# EAGLE design Cosmic Pi Main Board V2.5 OHL no logo (EAGLE 8.3.1)
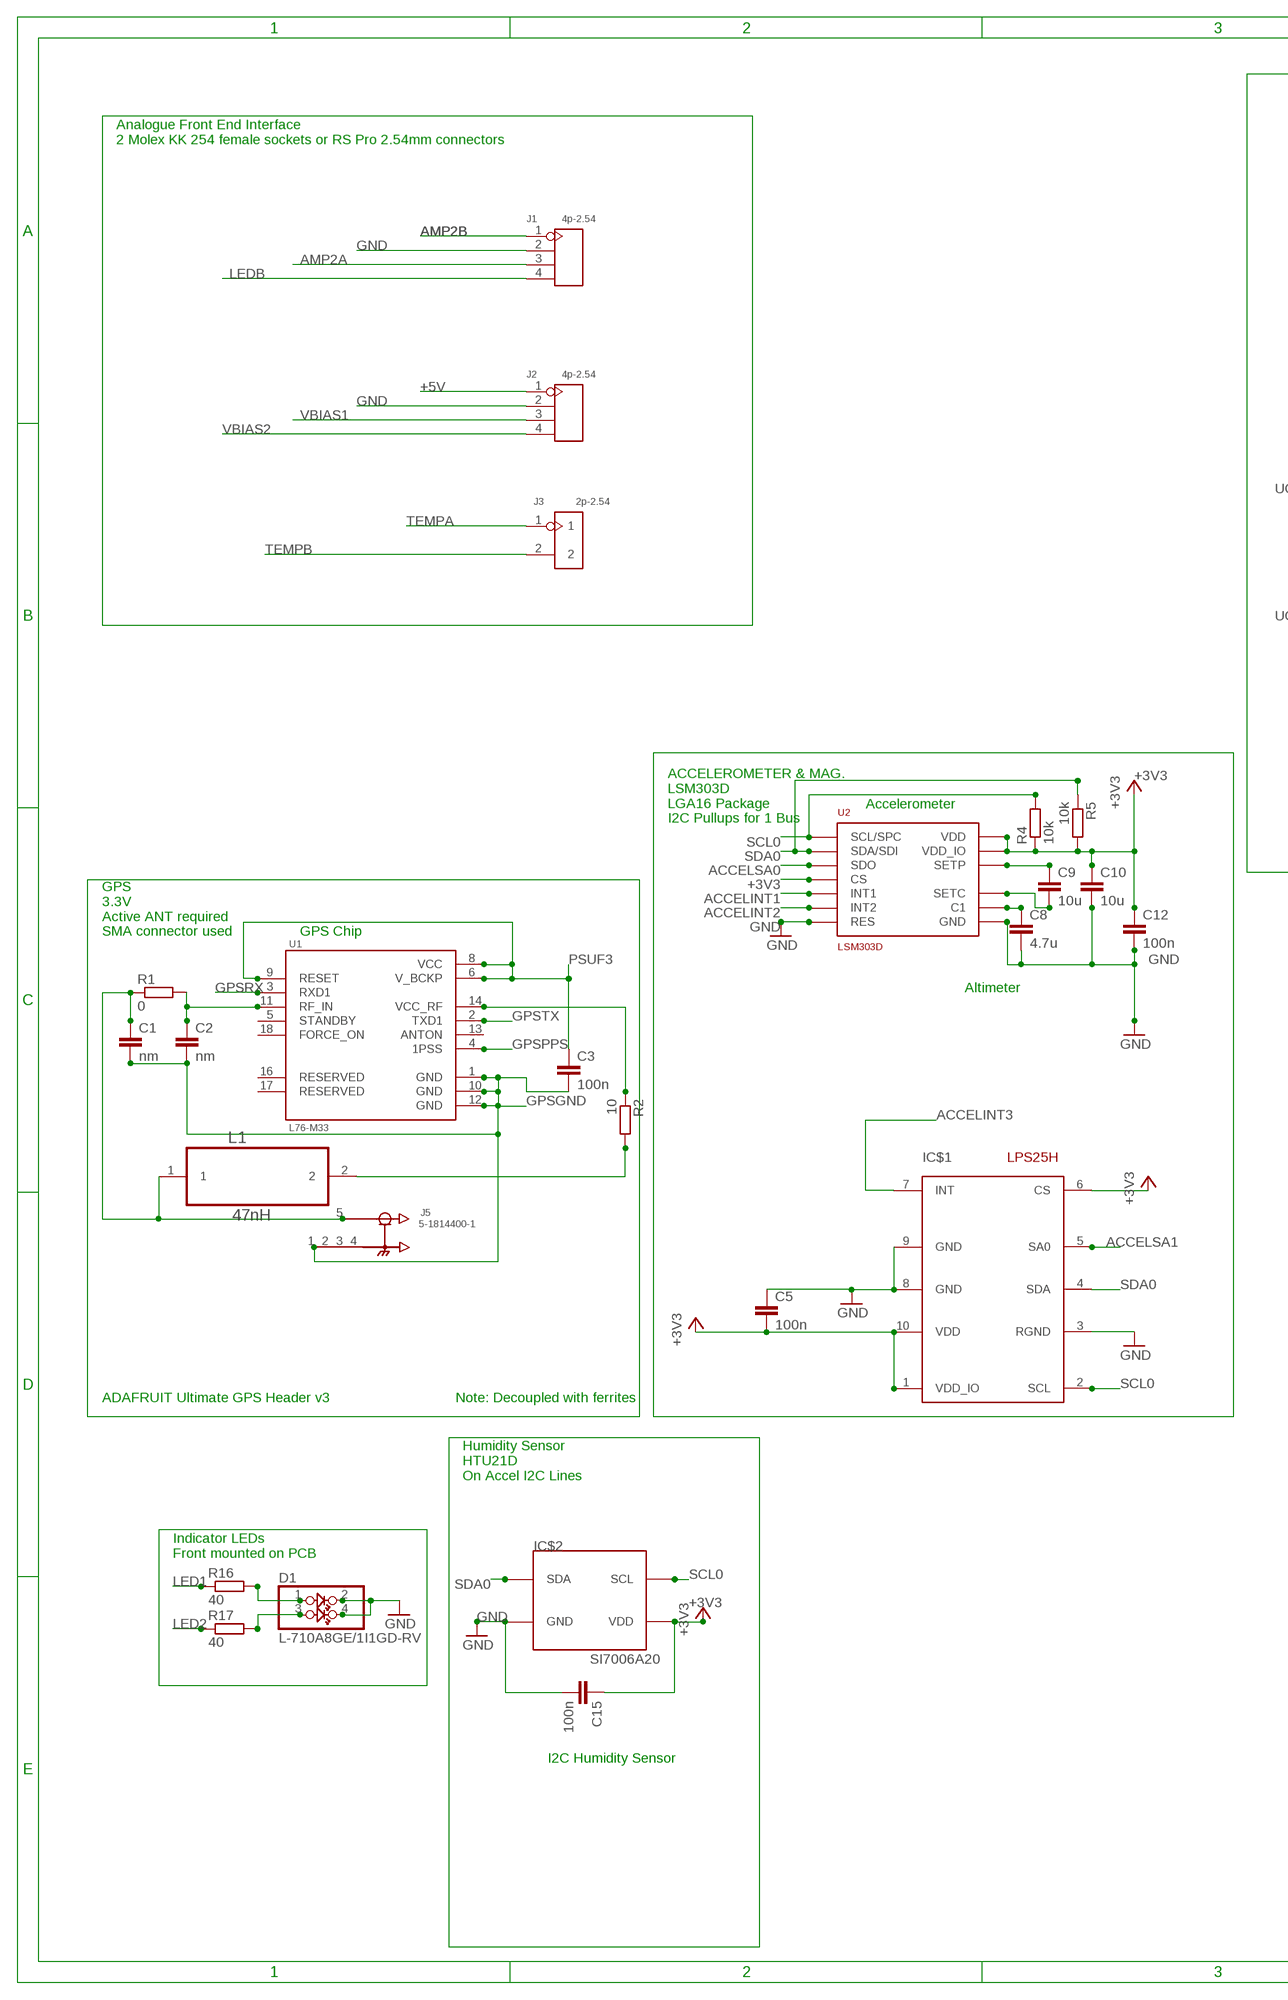
[diagram p0: schematic, sheet 1, part 1 of 2]
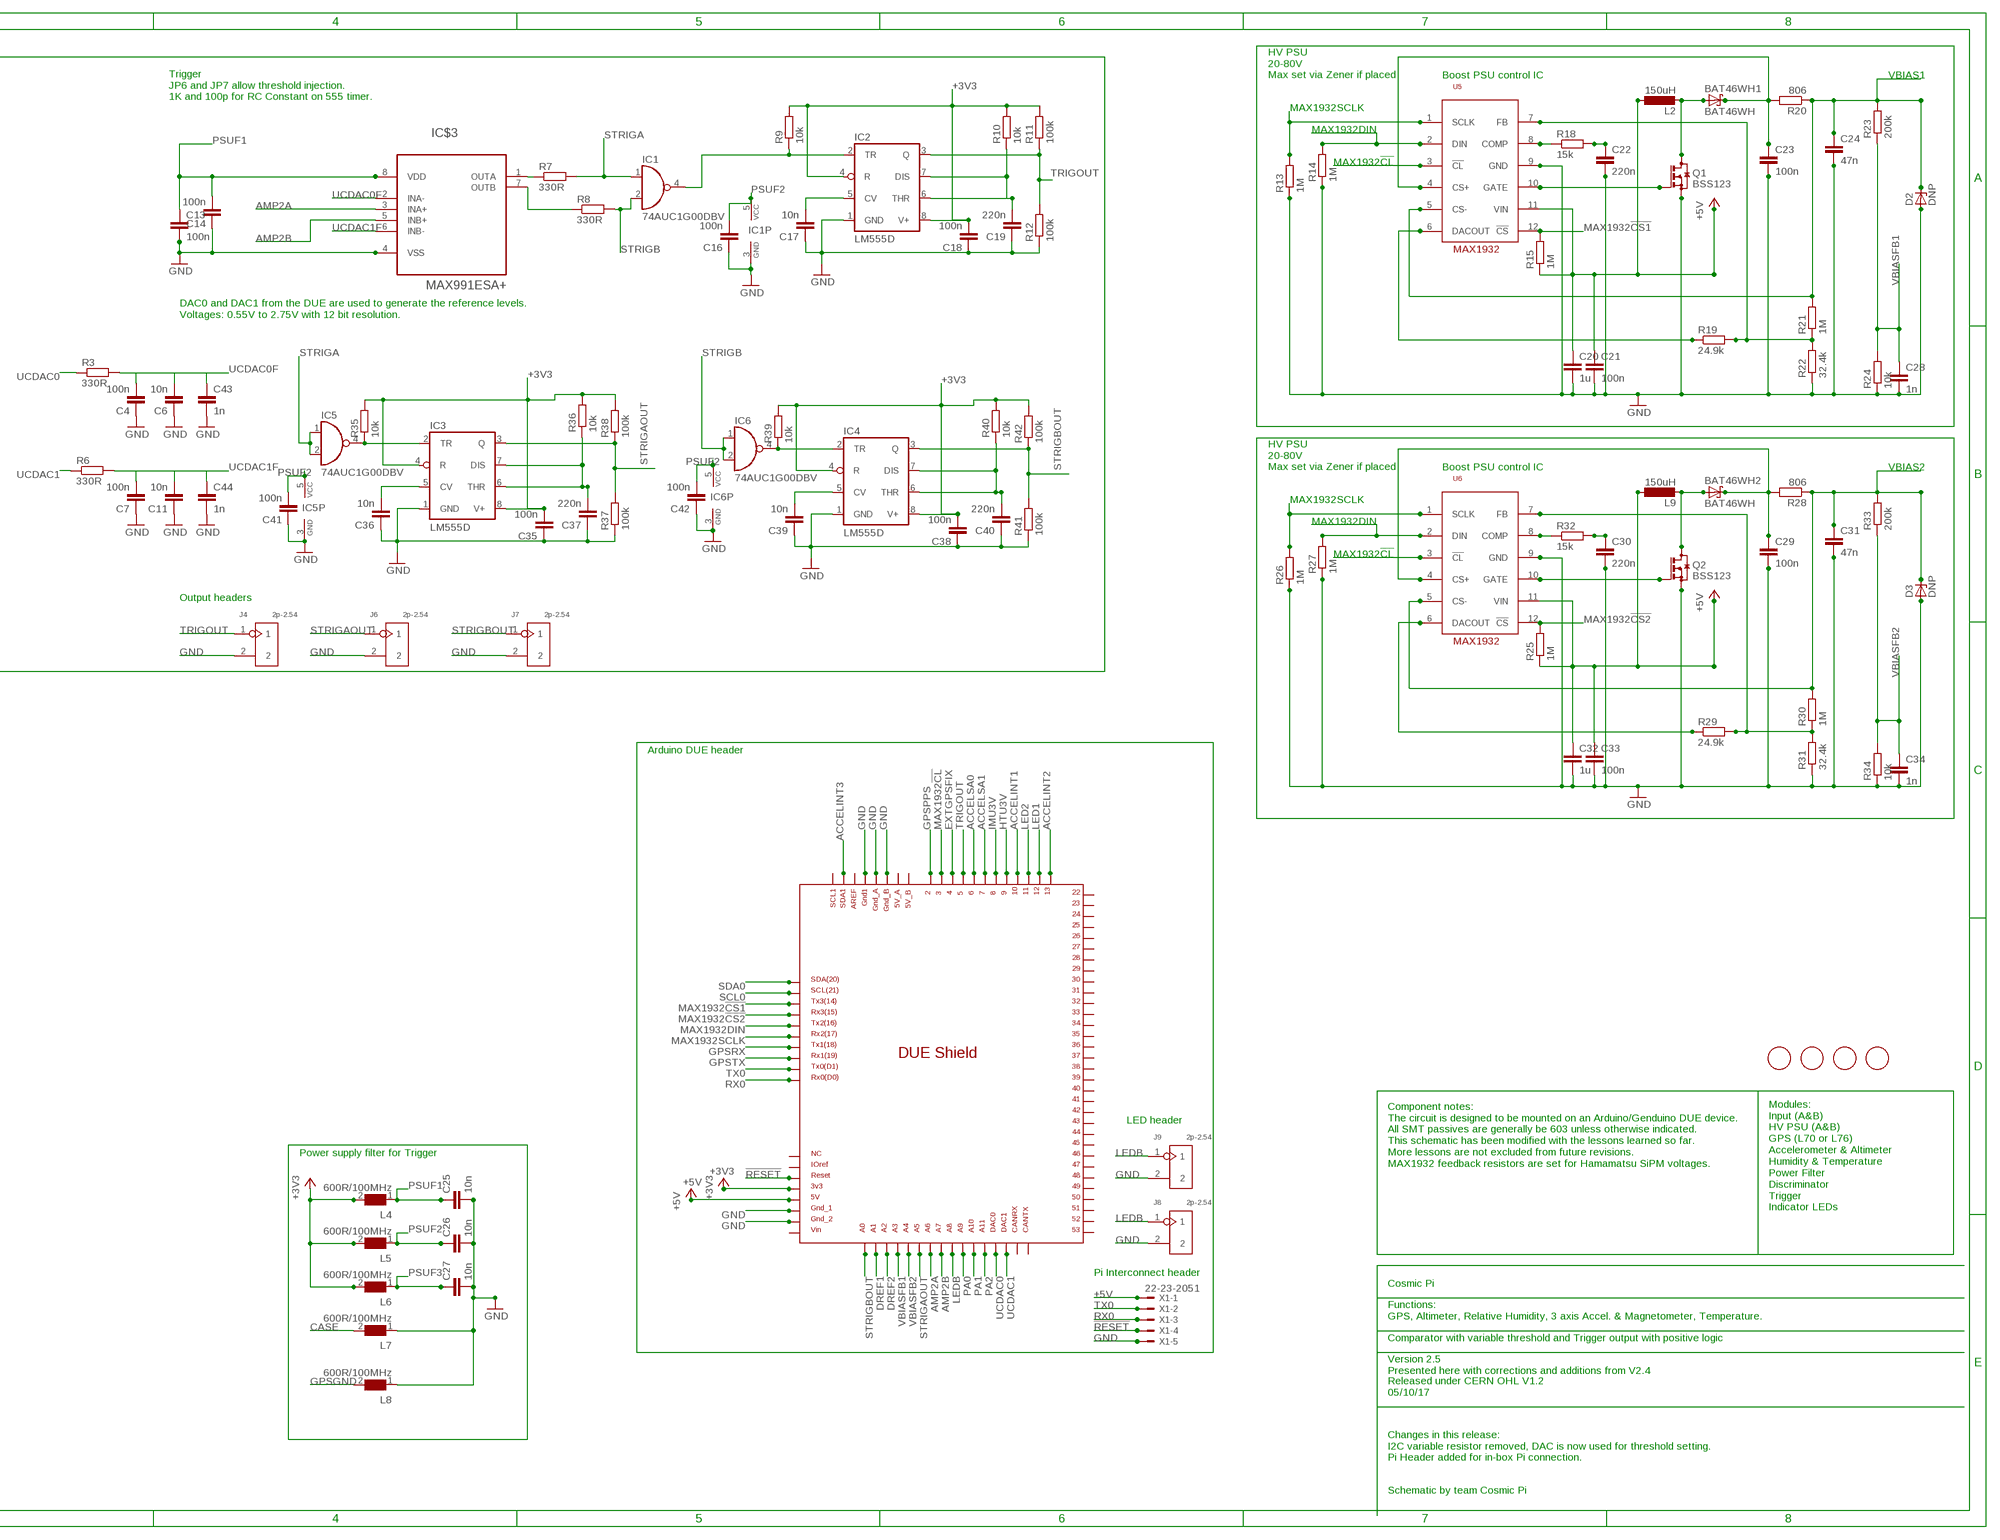
[diagram p1: schematic, sheet 1, part 2 of 2]

## Parts
BAT46WH1  BAT46WH  [SOD123F]
BAT46WH2  BAT46WH  [SOD123F]
C1  nm  C-EUC0603  [C0603]
C2  nm  C-EUC0603  [C0603]
C3  100n  C-EUC0603  [C0603]
C4  100n  C-EUC0603  [C0603]
C5  100n  C-EUC0603  [C0603]
C6  10n  C-EUC0603  [C0603]
C7  100n  C-EUC0603  [C0603]
C8  4.7u  C-EUC0603  [C0603]
C9  10u  C-EUC0603  [C0603]
C10  10u  C-EUC0603  [C0603]
C11  10n  C-EUC0603  [C0603]
C12  100n  C-EUC0603  [C0603]
C13  100n  C-EUC0603  [C0603]
C14  100n  C-EUC0603  [C0603]
C15  100n  C-EUC0603  [C0603]
C16  100n  C-EUC0603  [C0603]
C17  10n  C-EUC0603  [C0603]
C18  100n  C-EUC0603  [C0603]
C19  220n  C-EUC0603  [C0603]
C20  1u  C-EUC0603  [C0603]
C21  100n  C-EUC0603  [C0603]
C22  220n  C-EUC0603  [C0603]
C23  100n  C-EUC0603  [C0603]
C24  47n  C-EUC0603  [C0603]
C25  10n  C-EUC0603  [C0603]
C26  10n  C-EUC0603  [C0603]
C27  10n  C-EUC0603  [C0603]
C28  1n  C-EUC0603  [C0603]
C29  100n  C-EUC0603  [C0603]
C30  220n  C-EUC0603  [C0603]
C31  47n  C-EUC0603  [C0603]
C32  1u  C-EUC0603  [C0603]
C33  100n  C-EUC0603  [C0603]
C34  1n  C-EUC0603  [C0603]
C35  100n  C-EUC0603  [C0603]
C36  10n  C-EUC0603  [C0603]
C37  220n  C-EUC0603  [C0603]
C38  100n  C-EUC0603  [C0603]
C39  10n  C-EUC0603  [C0603]
C40  220n  C-EUC0603  [C0603]
C41  100n  C-EUC0603  [C0603]
C42  100n  C-EUC0603  [C0603]
C43  1n  C-EUC0603  [C0603]
C44  1n  C-EUC0603  [C0603]
D1  L-710A8GE/1I1GD-RV  KINGBRITET1  [2X02]
D2  DNP  ZENER-DIODESOT23  [SOT23]
D3  DNP  ZENER-DIODESOT23  [SOT23]
DUE1  DUE(NORMAL)  [DUE(NORMAL)]
IC1  74AUC1G00DBV  [SOT23-5]
IC2  LM555D  [SO08]
IC3  LM555D  [SO08]
IC4  LM555D  [SO08]
IC5  74AUC1G00DBV  [SOT23-5]
IC6  74AUC1G00DBV  [SOT23-5]
IC$1  LPS25H  [LPS25H]
IC$2  SI7006A20  [3X3DFN]
IC$3  MAX991ESA+  [SOIC-8]
J1  4p-2.54  DIP-BLACK-FEMALE-HEADER-VERT(4P-2.54)  [H4-2.54]
J2  4p-2.54  DIP-BLACK-FEMALE-HEADER-VERT(4P-2.54)  [H4-2.54]
J3  2p-2.54  DIP-BLACK-MALE-HEADER-VERT(2P-2.54)  [H2-2.54]
J4  2p-2.54  DIP-BLACK-MALE-HEADER-VERT(2P-2.54)  [H2-2.54]
J5  5-1814400-1  [TE_5-1814400-1]
J6  2p-2.54  DIP-BLACK-MALE-HEADER-VERT(2P-2.54)  [H2-2.54]
J7  2p-2.54  DIP-BLACK-MALE-HEADER-VERT(2P-2.54)  [H2-2.54]
J8  2p-2.54  DIP-BLACK-MALE-HEADER-VERT(2P-2.54)  [H2-2.54]
J9  2p-2.54  DIP-BLACK-MALE-HEADER-VERT(2P-2.54)  [H2-2.54]
L1  47nH  B82496C3470J  [INDC1608X90N]
L2  150uH  L-EUL1812  [L1812]
L4  600R/100MHz  WE-CBF-74279218_1206  [1206]
L5  600R/100MHz  WE-CBF-74279218_1206  [1206]
L6  600R/100MHz  WE-CBF-74279218_1206  [1206]
L7  600R/100MHz  WE-CBF-74279218_1206  [1206]
L8  600R/100MHz  WE-CBF-74279218_1206  [1206]
L9  150uH  L-EUL1812  [L1812]
Q1  BSS123  [SOT23]
Q2  BSS123  [SOT23]
R1  0  R-EU_R0603  [R0603]
R2  10  R-EU_R0603  [R0603]
R3  330R  R-EU_R0603  [R0603]
R4  10k  R-EU_R0603  [R0603]
R5  10k  R-EU_R0603  [R0603]
R6  330R  R-EU_R0603  [R0603]
R7  330R  R-EU_R0603  [R0603]
R8  330R  R-EU_R0603  [R0603]
R9  10k  R-EU_R0603  [R0603]
R10  10k  R-EU_R0603  [R0603]
R11  100k  R-EU_R0603  [R0603]
R12  100k  R-EU_R0603  [R0603]
R13  1M  R-EU_R0603  [R0603]
R14  1M  R-EU_R0603  [R0603]
R15  1M  R-EU_R0603  [R0603]
R16  40  R-EU_R0603  [R0603]
R17  40  R-EU_R0603  [R0603]
R18  15k  R-EU_R0603  [R0603]
R19  24.9k  R-EU_R0603  [R0603]
R20  806  R-EU_R0603  [R0603]
R21  1M  R-EU_R0603  [R0603]
R22  32.4k  R-EU_R0603  [R0603]
R23  200k  R-EU_R0603  [R0603]
R24  10k  R-EU_R0603  [R0603]
R25  1M  R-EU_R0603  [R0603]
R26  1M  R-EU_R0603  [R0603]
R27  1M  R-EU_R0603  [R0603]
R28  806  R-EU_R0603  [R0603]
R29  24.9k  R-EU_R0603  [R0603]
R30  1M  R-EU_R0603  [R0603]
R31  32.4k  R-EU_R0603  [R0603]
R32  15k  R-EU_R0603  [R0603]
R33  200k  R-EU_R0603  [R0603]
R34  10k  R-EU_R0603  [R0603]
R35  10k  R-EU_R0603  [R0603]
R36  10k  R-EU_R0603  [R0603]
R37  100k  R-EU_R0603  [R0603]
R38  100k  R-EU_R0603  [R0603]
R39  10k  R-EU_R0603  [R0603]
R40  10k  R-EU_R0603  [R0603]
R41  100k  R-EU_R0603  [R0603]
R42  100k  R-EU_R0603  [R0603]
U1  L76-M33  [CAPCAV110P970X1010X250-18N]
U2  LSM303D  [LGA16L]
U5  MAX1932  [TQFN-12]
U6  MAX1932  [TQFN-12]
U$1  FIDUCIAL  [FIDUCIAL_1MM]
U$2  FIDUCIAL  [FIDUCIAL_1MM]
U$3  FIDUCIAL  [FIDUCIAL_1MM]
U$4  FIDUCIAL  [FIDUCIAL_1MM]
X1  22-23-2051  [22-23-2051]

## Nets
!RESET: DUE1.RESET X1.4
+3V3 [Peripheral]: C5.2 C10.1 C12.1 C15.1 C18.2 C35.2 C38.2 DUE1.3V3 IC2.4(R) IC2.8(V+) IC3.4(R) IC3.8(V+) IC4.4(R) IC4.8(V+) IC$1.1(VDD_IO) IC$1.6(CS) IC$1.10(VDD) IC$2.P$5(VDD) L4.2 L5.2 L6.2 R4.1 R5.2 R9.2 R10.2 R11.2 R35.2 R36.2 R38.2 R39.2 R40.2 R42.2 U2.P$1(VDD_IO) U2.P$8(CS) U2.P$14(VDD)
+5V [PSU]: C20.1 C21.1 C32.1 C33.1 DUE1.5V J2.1 L2.1 L9.1 R15.1 R25.1 U5.11(VIN) U6.11(VIN) X1.1
ACCELINT1 [Peripheral]: DUE1.10 U2.P$11(INT1)
ACCELINT2 [Peripheral]: DUE1.13 U2.P$9(INT2)
ACCELINT3 [Peripheral]: DUE1.SDA1 IC$1.7(INT)
ACCELSA0 [Peripheral]: DUE1.6 U2.P$7(SDO)
ACCELSA1 [Peripheral]: DUE1.7 IC$1.5(SA0)
AMP2A [timing]: DUE1.A6 IC$3.3(INA+) J1.3
AMP2B [timing]: DUE1.A7 IC$3.5(INB+) J1.1
CASE [gnd]: L7.2
DREF1 [Peripheral]: DUE1.A1
DREF2 [Peripheral]: DUE1.A2
EXTGPSFIX [Peripheral]: DUE1.4
GND: C4.1 C5.1 C6.1 C7.1 C8.2 C10.2 C11.1 C12.2 C13.2 C14.1 C15.2 C16.1 C17.1 C18.1 C19.1 C20.2 C21.2 C22.2 C23.2 C24.2 C25.2 C26.2 C27.2 C28.2 C29.2 C30.2 C31.2 C32.2 C33.2 C34.2 C35.1 C36.1 C37.1 C38.1 C39.1 C40.1 C41.1 C42.1 C43.2 C44.2 D1.2 D1.4 D2.1(A) D3.1(A) DUE1.GND1 DUE1.GND_1 DUE1.GND_2 DUE1.GND_A DUE1.GND_B IC1.3(GND) IC2.1(GND) IC3.1(GND) IC4.1(GND) IC5.3(GND) IC6.3(GND) IC$1.3(RGND) IC$1.8(GND) IC$1.9(GND) IC$2.P$2(GND) IC$3.4(VSS) J1.2 J2.2 J4.2 J6.2 J7.2 J8.2 J9.2 L7.1 L8.1 Q1.2(S) Q2.2(S) R12.1 R13.1 R14.1 R22.1 R24.1 R26.1 R27.1 R31.1 R34.1 R37.1 R41.1 U2.P$5(GND) U2.P$10(RES) U2.P$12(GND) U2.P$13(GND) U2.P$16(GND) U5.9(GND) U6.9(GND) X1.5
GPSGND [timing]: C1.2 C2.2 C3.2 J5.1(GND) L8.2 U1.1(GND) U1.10(GND) U1.12(GND)
GPSPPS [timing]: DUE1.2 U1.4(1PSS)
GPSRX [Comms]: DUE1.TX1 U1.3(RXD1)
GPSTX [Comms]: DUE1.RX1 U1.2(TXD1)
HTU3V [Peripheral]: DUE1.9
IMU3V [Peripheral]: DUE1.8
LED1: DUE1.12 R16.1
LED2: DUE1.11 R17.1
LEDB: DUE1.A8 J1.4 J8.1 J9.1
MAX1932!CL: DUE1.3 U5.3(!CL) U6.3(!CL)
MAX1932!CS1: DUE1.TX3 R15.2 U5.12(!CS)
MAX1932!CS2: DUE1.RX3 R25.2 U6.12(!CS)
MAX1932DIN: DUE1.TX2 R14.2 R27.2 U5.2(DIN) U6.2(DIN)
MAX1932SCLK: DUE1.RX2 R13.2 R26.2 U5.1(SCLK) U6.1(SCLK)
N$2: IC$3.1(OUTA) R7.1
N$4: IC$3.7(OUTB) R8.1
N$5 [Peripheral]: C17.2 IC2.5(CV)
N$6 [Peripheral]: C19.2 IC2.6(THR) IC2.7(DIS) R10.1
N$7 [Peripheral]: C36.2 IC3.5(CV)
N$8: Q2.1(G) U6.10(GATE)
N$9 [Vbias]: BAT46WH2.2(A) L9.2 Q2.3(D)
N$10 [Vbias]: BAT46WH2.1(K) C29.1 R28.2 U6.4(CS+)
N$11: R29.1 U6.6(DACOUT)
N$12: R32.1 U6.8(COMP)
N$13: C30.1 R32.2
N$14: R29.2 R30.1 R31.2 U6.7(FB)
N$17 [Peripheral]: C37.2 IC3.6(THR) IC3.7(DIS) R36.1
N$18: IC1.4(O) IC2.2(TR) R9.1
N$19: Q1.1(G) U5.10(GATE)
N$21 [Peripheral]: C39.2 IC4.5(CV)
N$22 [Peripheral]: C40.2 IC4.6(THR) IC4.7(DIS) R40.1
N$24: IC4.2(TR) IC6.4(O) R39.1
N$25: IC3.2(TR) IC5.4(O) R35.1
N$31 [Vbias]: BAT46WH1.2(A) L2.2 Q1.3(D)
N$32 [Vbias]: BAT46WH1.1(K) C23.1 R20.2 U5.4(CS+)
N$47: R19.2 R21.1 R22.2 U5.7(FB)
N$53 [ant]: C1.1 J5.5(SIG) L1.1 R1.1
N$54: R19.1 U5.6(DACOUT)
N$55: R18.1 U5.8(COMP)
N$56: C22.1 R18.2
N$63 [Peripheral]: C9.1 U2.P$3(SETP)
N$64 [Peripheral]: C9.2 U2.P$2(SETC)
N$65 [Peripheral]: C8.1 U2.P$15(C1)
N$66 [Peripheral]: L1.2 R2.2
N$67 [Peripheral]: R2.1 U1.14(VCC_RF)
N$68 [ant]: C2.1 R1.2 U1.11(RF_IN)
N$72: D1.1 R16.2
N$73: D1.3 R17.2
PA0 [Peripheral]: DUE1.A9
PA1 [Peripheral]: DUE1.A10
PA2 [Peripheral]: DUE1.A11
PSUF1 [PSU]: C13.1 C14.2 C25.1 IC$3.8(VDD) L4.1
PSUF2 [PSU]: C16.2 C26.1 C41.2 C42.2 IC1.5(VCC) IC5.5(VCC) IC6.5(VCC) L5.1
PSUF3 [timing]: C3.1 C27.1 L6.1 U1.6(V_BCKP) U1.8(VCC) U1.9(RESET)
RX0: DUE1.RX0 X1.3
SCL0 [Comms]: DUE1.SCL IC$1.2(SCL) IC$2.P$6(SCL) R4.2 U2.P$4(SCL/SPC)
SDA0 [Comms]: DUE1.SDA IC$1.4(SDA) IC$2.P$1(SDA) R5.1 U2.P$6(SDA/SDI)
STRIGA [timing]: IC1.1(I0) IC5.1(I0) IC5.2(I1) R7.2
STRIGAOUT [timing]: DUE1.A5 IC3.3(Q) J6.1 R37.2 R38.1
STRIGB [timing]: IC1.2(I1) IC6.1(I0) IC6.2(I1) R8.2
STRIGBOUT [timing]: DUE1.A0 IC4.3(Q) J7.1 R41.2 R42.1
TEMPA: J3.1
TEMPB: J3.2
TRIGOUT [timing]: DUE1.5 IC2.3(Q) J4.1 R11.1 R12.2
TX0: DUE1.TX0 X1.2
UCDAC0: DUE1.DAC0 R3.1
UCDAC0F: C4.2 C6.2 C43.1 IC$3.2(INA-) R3.2
UCDAC1: DUE1.DAC1 R6.1
UCDAC1F: C7.2 C11.2 C44.1 IC$3.6(INB-) R6.2
VBIAS1 [Vbias]: C24.1 D2.3(C) J2.3 R20.1 R21.2 R23.2 U5.5(CS-)
VBIAS2 [Vbias]: C31.1 D3.3(C) J2.4 R28.1 R30.2 R33.2 U6.5(CS-)
VBIASFB1: C28.1 DUE1.A3 R23.1 R24.2
VBIASFB2: C34.1 DUE1.A4 R33.1 R34.2
Unconnected: DUE1.5V_A DUE1.5V_B DUE1.22 DUE1.23 DUE1.24 DUE1.25 DUE1.26 DUE1.27 DUE1.28 DUE1.29 DUE1.30 DUE1.31 DUE1.32 DUE1.33 DUE1.34 DUE1.35 DUE1.36 DUE1.37 DUE1.38 DUE1.39 DUE1.40 DUE1.41 DUE1.42 DUE1.43 DUE1.44 DUE1.45 DUE1.46 DUE1.47 DUE1.48 DUE1.49 DUE1.50 DUE1.51 DUE1.52 DUE1.53 DUE1.AREF DUE1.CANRX DUE1.CANTX DUE1.IOREF DUE1.NC DUE1.SCL1 DUE1.VIN J5.2(GND) J5.3(GND) J5.4(GND) U1.5(STANDBY) U1.13(ANTON) U1.16(RESERVED) U1.17(RESERVED) U1.18(FORCE_ON)

## Notes on the sheet
- HV PSU
  20-80V
  Max set via Zener if placed
- Boost PSU control IC
- Trigger
  JP6 and JP7 allow threshold injection.
  1K and 100p for RC Constant on 555 timer.
- Analogue Front End Interface
  2 Molex KK 254 female sockets or RS Pro 2.54mm connectors
- DAC0 and DAC1 from the DUE are used to generate the reference levels.
  Voltages: 0.55V to 2.75V with 12 bit resolution.
- HV PSU
  20-80V
  Max set via Zener if placed
- Boost PSU control IC
- Output headers
- Accelerometer
- ACCELEROMETER & MAG.
  LSM303D
  LGA16 Package
  I2C Pullups for 1 Bus
- GPS
  3.3V
  Active ANT required
  SMA connector used
- GPS Chip
- Arduino DUE header
- Altimeter
- ADAFRUIT Ultimate GPS Header v3 | Note: Decoupled with ferrites
- LED header
- Humidity Sensor
  HTU21D
  On Accel I2C Lines
- Power supply filter for Trigger
- Component notes:
  The circuit is designed to be mounted on an Arduino/Genduino DUE device.
  All SMT passives are generally be 603 unless otherwise indicated.
  This schematic has been modified with the lessons learned so far.
  More lessons are not excluded from future revisions.
  MAX1932 feedback resistors are set for Hamamatsu SiPM voltages.
- Indicator LEDs
  Front mounted on PCB
- Modules:
  Input (A&B)
  HV PSU (A&B)
  GPS (L70 or L76)
  Accelerometer & Altimeter
  Humidity & Temperature
  Power Filter
  Discriminator
  Trigger
  Indicator LEDs
- Pi Interconnect header
- Cosmic Pi
- Functions:
  GPS, Altimeter, Relative Humidity, 3 axis Accel. & Magnetometer, Temperature.
- Comparator with variable threshold and Trigger output with positive logic
- I2C Humidity Sensor
- Version 2.5
  Presented here with corrections and additions from V2.4
- Released under CERN OHL V1.2
  05/10/17
- Changes in this release:
  I2C variable resistor removed, DAC is now used for threshold setting.
  Pi Header added for in-box Pi connection.
- Schematic by team Cosmic Pi

## Library data of the parts
BAT46WH1 BAT46WH2 = BAT46Wsymbol:BAT46W: Single Schottky barrier diode Single planar Schottky barrier diode with an integrated guard ring for stress protection, encapsulated in a Surface-Mounted Device (SMD) plastic package. AAL Eindhoven MK
C1-C21 C25-C27 C32 C33 C35-C42 = resistor:C-EU: CAPACITOR, European symbol
C22-C24 C28-C31 C34 C43 C44 = rcl:C-EU: CAPACITOR, European symbol
D1 = KingbriteBiLevel T1:KINGBRITET1: PIN HEADER
D2 D3 = diode:ZENER-DIODE: Z-Diode
DUE1 = DUElib130425:DUE(NORMAL)
IC1 IC5 IC6 = 74xx-little-de:74*1G00: 2-input NAND gate
IC2-IC4 = linear:*555: TIMER
IC$1 = LPS25H:LPS25H: ST-Micro Piezoresistive pressure sensor
IC$2 = SI7006:SI7006
IC$3 = MAX9916EKA_T:MAX991ESA+
J1 J2 = Seeed-Connector:DIP-BLACK-FEMALE-HEADER-VERT(4P-2.54): 320030017; MPN: F185-1104A1BSYA1
J3 J4 J6-J9 = Seeed-Connector:DIP-BLACK-MALE-HEADER-VERT(2P-2.54): 320020016; MPN: P125-1102A0BS116A1
J5 = 5-1814400-1:5-1814400-1: Conn SMA RCP 0Hz to 3GHz 50Ohm Solder RA Thru-Hole Gold Over Nickel Over Copper
L1 = B82496C3470J:B82496C3470J: INDUCTOR, 47NH 270MA 5%
L2 L9 = rcl:L-EU: INDUCTOR, European symbol
L4-L8 = WE-CBF:WE-CBF: SMD EMI Suppression Ferrite Beads WE-CBF - Excellent anti-EMI properties - Low DC-restistance - Impedances till 3000 ohms - Rated current up to 6 A -- Reliable Ni-Sn electrodes -- Perfect as data lined filter and for uncoupling of distribution voltage; MPN: 74279218; OC_FARNELL: 1635758; OC_NEWARK: 08P2403; PACKAGE: IND-1206; SUPPLIER: Wuerth Elektronik
Q1 Q2 = transistor-small-signal:BSS123: N-CHANNEL MOS FET
R1-R42 = resistor:R-EU_: RESISTOR, European symbol
U1 = L76-M33:L76-M33: GPS Receiver 1575.42MHz 2.5V/3.3V 18-Pin
U2 = LSM303D:LSM303D
U5 U6 = TQFN-12:MAX1932
U$1-U$4 = adafruit:FIDUCIAL: For use by pick and place machines to calibrate the vision/machine, 1mm By microbuilder.eu
X1 = con-molex:22-23-2051: .100" (2.54mm) Center Header - 5 Pin; MF: MOLEX; MPN: 22-23-2051; OC_FARNELL: 1462952; OC_NEWARK: 38C9178

## Net classes
0 default: width 0.152 mm, drill 0.406 mm, clearance 0.152 mm
1 Peripheral: width 0.152 mm, drill 0.406 mm, clearance 0.152 mm to class 0, clearance 0.152 mm
2 gnd: width 0.305 mm, drill 0.406 mm, clearance 0.205 mm to class 0, clearance 0.205 mm to class 1, clearance 0.254 mm
3 timing: width 0.152 mm, drill 0.406 mm, clearance 0.152 mm to class 0, clearance 0.152 mm to class 1, clearance 0.152 mm to class 2, clearance 0.152 mm
4 Comms: width 0.152 mm, drill 0.406 mm, clearance 0.152 mm to class 0, clearance 0.152 mm to class 1, clearance 0.152 mm to class 2, clearance 0.152 mm to class 3, clearance 0.152 mm
5 PSU: width 0.152 mm, drill 0.406 mm, clearance 0.152 mm to class 0, clearance 0.152 mm to class 1, clearance 0.152 mm to class 2, clearance 0.152 mm to class 3, clearance 0.152 mm to class 4, clearance 0.152 mm
6 Vbias: width 0.152 mm, drill 0.406 mm, clearance 0.254 mm to class 0, clearance 0.254 mm to class 1, clearance 0.254 mm to class 2, clearance 0.254 mm to class 3, clearance 0.254 mm to class 4, clearance 0.254 mm to class 5, clearance 0.356 mm
7 ant: width 0.61 mm, drill 0.406 mm, clearance 0.61 mm to class 0, clearance 0.61 mm to class 1, clearance 0.61 mm to class 2, clearance 0.61 mm to class 3, clearance 0.61 mm to class 4, clearance 0.61 mm to class 5, clearance 0.61 mm to class 6, clearance 0.61 mm

## Board
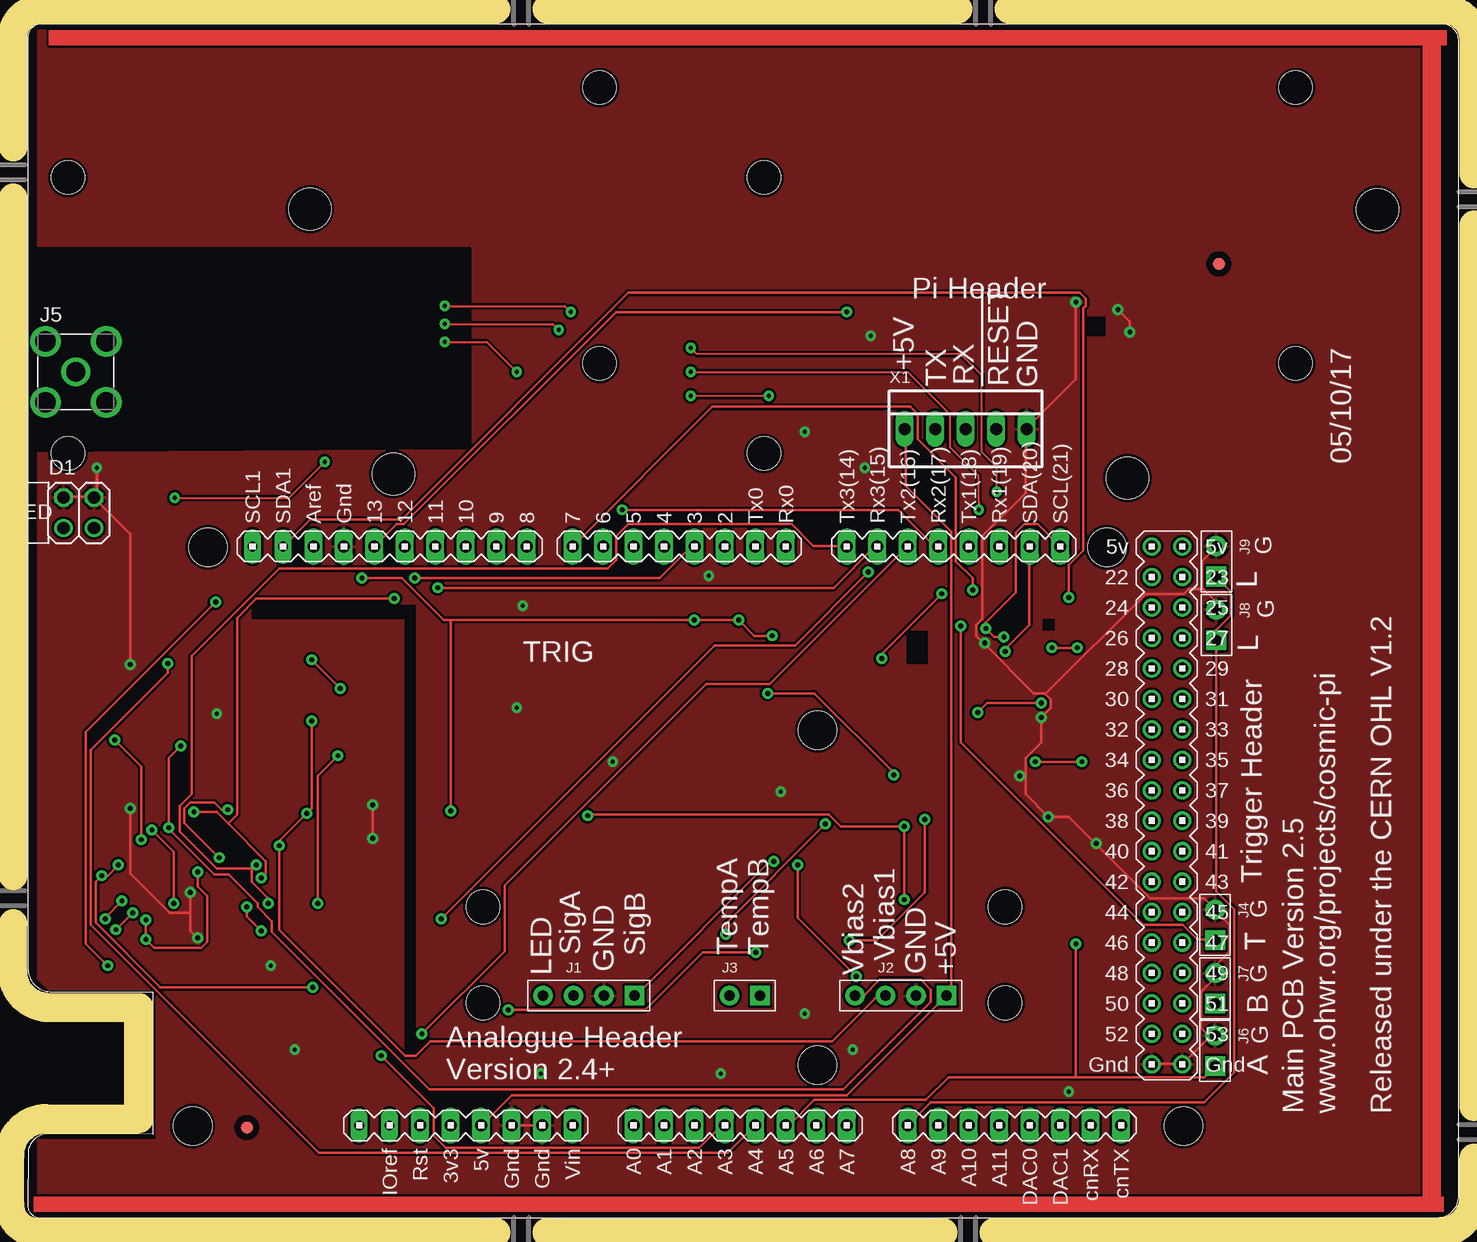
[diagram p2: board, top side]
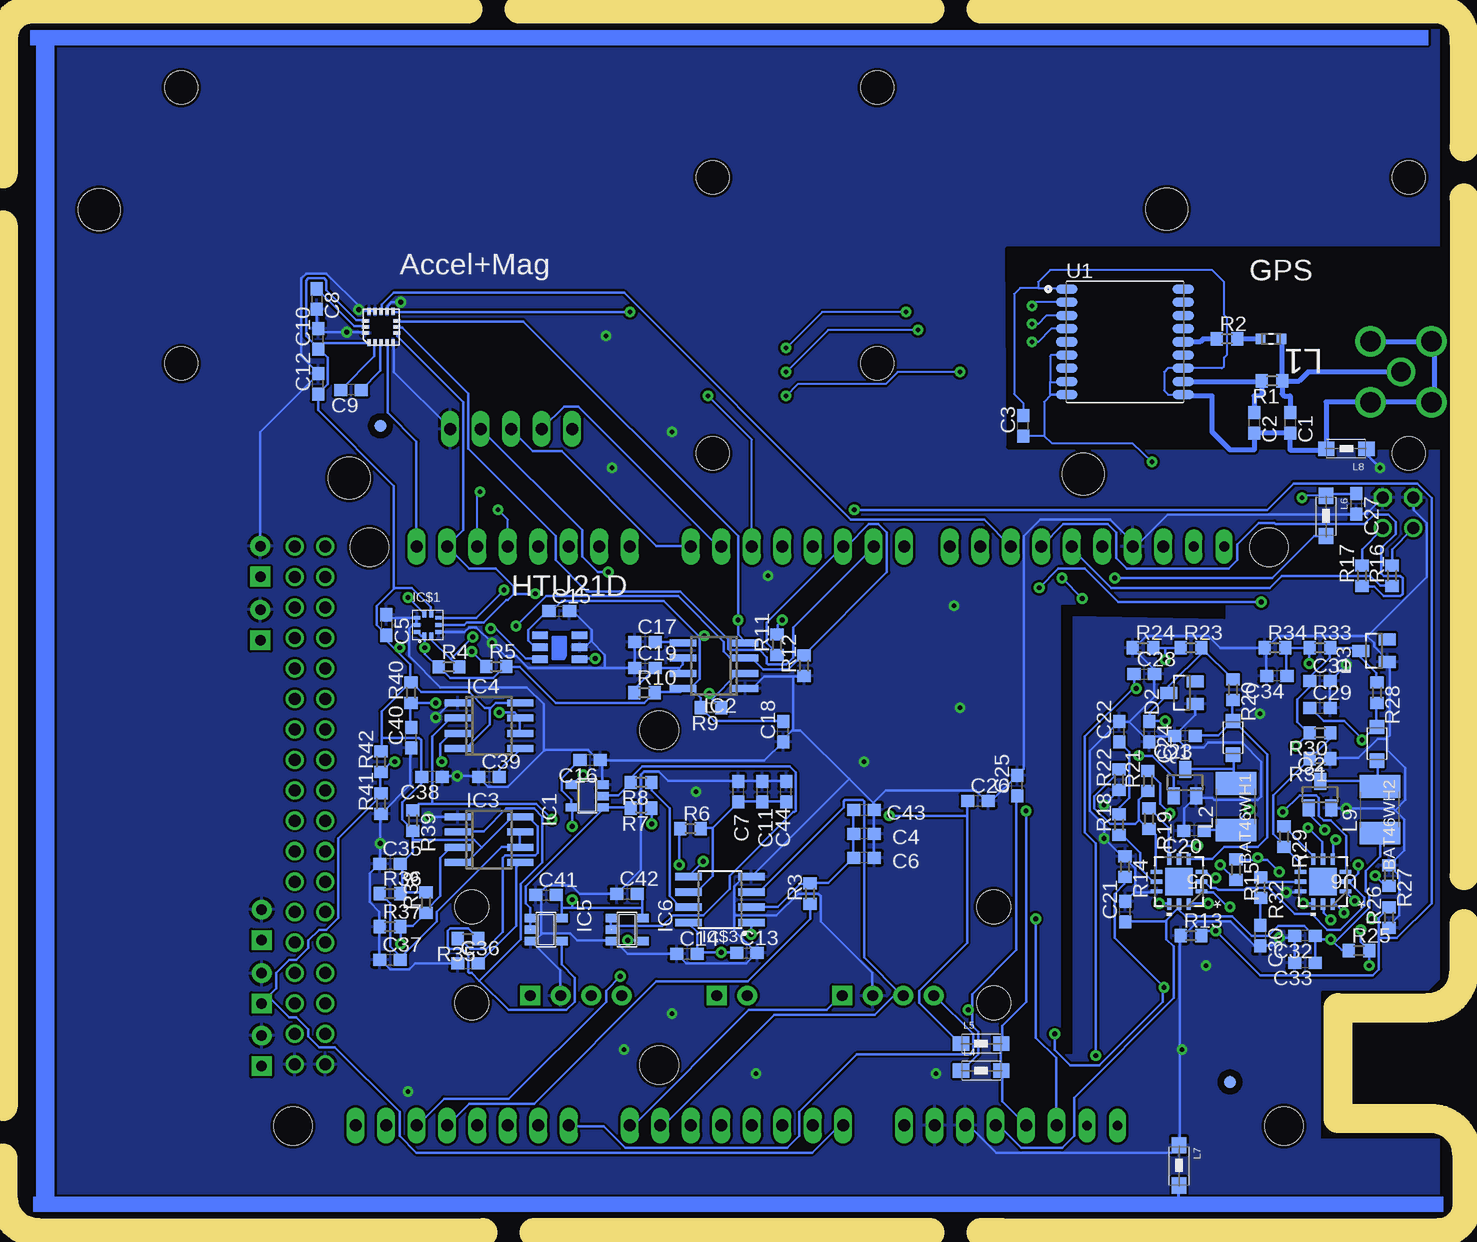
[diagram p3: board, bottom side, seen from below]

No outline drawn. Coordinates in mm, seen from the top.
Copper layers (1*16): Top 0.035mm / dielectric 1.5mm / Bottom 0.035mm
Design rules "pcbtrain github": minimum track width 0.2mm, minimum drill 0.4mm, track to track 0.2mm, track to pad 0.2mm, pad to pad 0.2mm, via to via 0.2mm, smd to smd 0mil, copper to edge 10mil, drill to drill 0.2mm, minimum pad ring 10mil, minimum via ring 10mil, stop-mask expansion 0.125mm, vias tented up to drill 0mil, thermal gap 10mil
Holes 3.2 mm at 96.58,7.62 15.27,55.88 90.2,55.88 14,7.62 66.07,40.64 66.07,12.7
Holes 2.8 mm at 81.69,17.89 38.19,17.89 81.69,25.89 38.19,25.89
Holes 3.5 mm at 23.76,84.07 91.89,61.64 112.72,84.03 30.72,61.99
Holes 2.75 mm at 3.6,86.7 61.6,86.7 3.6,63.7 61.6,63.7 47.9,94.2 105.9,94.2 47.9,71.2 105.9,71.2
tKeepout: area -0.2,6.8 to 10.8,18.9
bKeepout: area -0.2,6.7 to 10.8,18.9
tRestrict: area 23.6,68.2 to 30.9,77.8; area 73.5,46.2 to 75.2,48.9; area 84.8,48.9 to 85.8,49.9; area 88.5,73.5 to 90,75.1; area 0,0 to 1,2; area -0.2,97 to 0.8,99.5; area 19,13.8 to 32.5,51; area -0.5,64 to 37,80.7; area -0.2,-0.3 to 1,99.5; area 118.5,0.3 to 120.2,100.8; area -0.2,6.8 to 10.8,18.9
bRestrict: area 88.5,73.5 to 90,75.1; area 84.8,48.9 to 85.8,49.9; area 73.5,46.2 to 75.2,48.9; area 23.6,68.2 to 30.9,77.8; area 19,13.8 to 32.5,51; area 0,0 to 1,2; area -0.2,97 to 0.8,99.5; area -0.5,64.2 to 37,80.7; area 118.5,0.3 to 120.2,100.8; area -0.2,-0.3 to 1,99.5; area -0.1,6.7 to 10.8,18.9
Milling: 24 lines

### Footprints (pad centres in the part's own frame; a part is rotated, then mirrored left to right if it is on the bottom)
SOD123F = smd 1.2 x 1.2: 1 -1.4,0; 2 1.4,0
C0603 = smd 1.1 x 1: 1 -0.85,0; 2 0.85,0
2X02 = drill 1.016: 1 -1.27,-1.27; 3 1.27,-1.27 | drill 1.016 octagon: 2 -1.27,1.27; 4 1.27,1.27
SOT23 = smd 1 x 1.4: 1 -0.95,-1.1; 2 0.95,-1.1; 3 0,1.1
DUE(NORMAL) = drill 1 long: 2 -16.51,30.48; 3 -19.05,30.48; 3V3 -39.37,-17.78; 4 -21.59,30.48; 5 -24.13,30.48; 5V -36.83,-17.78; 6 -26.67,30.48; 7 -29.21,30.48; 8 -33.02,30.48; 9 -35.56,30.48; 10 -38.1,30.48; 11 -40.64,30.48; 12 -43.18,30.48; 13 -45.72,30.48; A0 -24.13,-17.78; A1 -21.59,-17.78; A2 -19.05,-17.78; A3 -16.51,-17.78; A4 -13.97,-17.78; A5 -11.43,-17.78; A6 -8.89,-17.78; A7 -6.35,-17.78; A8 -1.27,-17.78; A9 1.27,-17.78; A10 3.81,-17.78; A11 6.35,-17.78; AREF -50.8,30.48; AREF1 -50.8,30.48; CANRX 13.97,-17.78; CANTX 16.51,-17.78; DAC0 8.89,-17.78; DAC1 11.43,-17.78; GND1 -48.26,30.48; GND_1 -34.29,-17.78; GND_2 -31.75,-17.78; RESET -41.91,-17.78; RX0 -11.43,30.48; RX1 6.35,30.48; RX2 1.27,30.48; RX3 -3.81,30.48; SCL 11.43,30.48; SDA 8.89,30.48; TX0 -13.97,30.48; TX1 3.81,30.48; TX2 -1.27,30.48; TX3 -6.35,30.48; VIN -29.21,-17.78 | drill 1: 5V_A 19.05,30.48; 5V_B 21.59,30.48; 22 19.05,27.94; 23 21.59,27.94; 24 19.05,25.4; 25 21.59,25.4; 26 19.05,22.86; 27 21.59,22.86; 28 19.05,20.32; 29 21.59,20.32; 30 19.05,17.78; 31 21.59,17.78; 32 19.05,15.24; 33 21.59,15.24; 34 19.05,12.7; 35 21.59,12.7; 36 19.05,10.16; 37 21.59,10.16; 38 19.05,7.62; 39 21.59,7.62; 40 19.05,5.08; 41 21.59,5.08; 42 19.05,2.54; 43 21.59,2.54; 44 19.05,0; 45 21.59,0; 46 19.05,-2.54; 47 21.59,-2.54; 48 19.05,-5.08; 49 21.59,-5.08; 50 19.05,-7.62; 51 21.59,-7.62; 52 19.05,-10.16; 53 21.59,-10.16; GND_A 19.05,-12.7; GND_B 21.59,-12.7 | drill 0.8 pad 1.422 long: IOREF -44.45,-17.78; NC -46.99,-17.78; SCL1 -55.88,30.48; SDA1 -53.34,30.48
SOT23-5 = smd 0.69 x 0.99: 1 -0.95,-1.29; 2 0,-1.29; 3 0.95,-1.29; 4 0.95,1.3; 5 -0.95,1.3
SO08 = smd 0.6 x 2.2: 1 -1.905,-2.6; 2 -0.635,-2.6; 3 0.635,-2.6; 4 1.905,-2.6; 5 1.905,2.6; 6 0.635,2.6; 7 -0.635,2.6; 8 -1.905,2.6
LPS25H = smd 0.32 x 0.55: 1 -0.3,-0.9; 2 0.3,-0.9; 6 0.3,0.9; 7 -0.3,0.9 | smd 0.55 x 0.32: 3 0.9,-0.6; 4 0.9,0; 5 0.9,0.6; 8 -0.9,0.6; 9 -0.9,0; 10 -0.9,-0.6
3X3DFN = smd 1.27 x 0.635: P$1 -0.2,0; P$2 -0.2,-1; P$3 -0.2,-2; P$4 3.1,-2; P$5 3.1,-1; P$6 3.1,0
SOIC-8 = smd 0.61 x 2.21: 1 -1.905,-2.616; 2 -0.635,-2.616; 3 0.635,-2.616; 4 1.905,-2.616; 5 1.905,2.616; 6 0.635,2.616; 7 -0.635,2.616; 8 -1.905,2.616
H4-2.54 = drill 0.889 pad 1.651 square: 1 0,3.81 | drill 0.889 pad 1.651: 2 0,1.27; 3 0,-1.27; 4 0,-3.81
H2-2.54 = drill 0.889 pad 1.651 square: 1 0,1.27 | drill 0.889 pad 1.651: 2 0,-1.27
TE_5-1814400-1 = drill 1.7 pad 2.3: 1 -2.54,2.54; 2 -2.54,-2.54; 3 2.54,-2.54; 4 2.54,2.54 | drill 1.6 pad 2.2: 5 0,0
INDC1608X90N = smd 0.787 x 0.889: 1 -0.889,0; 2 0.889,0
L1812 = smd 1.9 x 3.4: 1 -1.95,0; 2 1.95,0
1206 = smd 1.35 x 1.2: 1 -1.675,0; 2 1.675,0
R0603 = smd 1 x 1.1: 1 -0.85,0; 2 0.85,0
CAPCAV110P970X1010X250-18N = smd 1.8 x 0.8: 1 -4.85,4.4; 2 -4.85,3.3; 3 -4.85,2.2; 4 -4.85,1.1; 5 -4.85,0; 6 -4.85,-1.1; 7 -4.85,-2.2; 8 -4.85,-3.3; 9 -4.85,-4.4; 10 4.85,-4.4; 11 4.85,-3.3; 12 4.85,-2.2; 13 4.85,-1.1; 14 4.85,0; 15 4.85,1.1; 16 4.85,2.2; 17 4.85,3.3; 18 4.85,4.4
LGA16L = smd 0.6 x 0.3: P$1 -1.3,1; P$2 -1.3,0.5; P$3 -1.3,0; P$4 -1.3,-0.5; P$5 -1.3,-1; P$9 1.3,-1; P$10 1.3,-0.5; P$11 1.3,0; P$12 1.3,0.5; P$13 1.3,1 | smd 0.3 x 0.6: P$6 -0.5,-1.3; P$7 0,-1.3; P$8 0.5,-1.3; P$14 0.5,1.3; P$15 0,1.3; P$16 -0.5,1.3
TQFN-12 = smd 0.965 x 0.356: 1 -1.867,0.813; 2 -1.867,0; 3 -1.867,-0.813; 7 1.867,-0.813; 8 1.867,0; 9 1.867,0.813 | smd 0.356 x 0.965: 4 -0.813,-1.867; 5 0,-1.867; 6 0.813,-1.867; 10 0.813,1.867; 11 0,1.867; 12 -0.813,1.867 | smd 2.261 x 2.261: 13 0,0
FIDUCIAL_1MM = smd 1 x 1: 1 0,0
22-23-2051 = drill 1 long: 1 -5.08,0; 2 -2.54,0; 3 0,0; 4 2.54,0; 5 5.08,0

### Placement (x,y rotation side)
BAT46WH1  18.25,40 270 bottom
BAT46WH2  6.25,39.5 270 bottom
C1  13.5,66.25 270 bottom
C2  16.5,66.25 270 bottom
C3  35.75,66 90 bottom
C4  49,32 180 bottom
C5  88.8,49.4 270 bottom
C6  49,30 180 bottom
C7  59.5,35.5 270 bottom
C8  94.62,76.57 270 bottom
C9  91.75,69 180 bottom
C10  94.5,73.25 90 bottom
C11  57.5,35.5 270 bottom
C12  94.5,69.5 90 bottom
C13  58.76,22.05 0 bottom
C14  63.75,22 0 bottom
C15  74.4,50.55 0 bottom
C16  71.82,38.13 180 bottom
C17  67.25,48 0 bottom
C18  55.75,40.5 90 bottom
C19  67.25,45.8 0 bottom
C20  21.5,32.25 180 bottom
C21  27.25,25.5 90 bottom
C22  27.75,40.5 90 bottom
C23  22.25,40.15 180 bottom
C24  25.25,40.5 270 bottom
C25  36.25,36 90 bottom
C26  39.5,34.75 0 bottom
C27  8,59.5 270 bottom
C28  25.65,45.3 0 bottom
C29  11,42.5 0 bottom
C30  16,23.5 270 bottom
C31  11,44.75 0 bottom
C32  12.25,23.5 180 bottom
C33  12.25,21.25 180 bottom
C34  14.6,45.15 180 bottom
C35  88.5,29.5 0 bottom
C36  82,21.2 0 bottom
C37  88.5,21.5 0 bottom
C38  85,36.75 180 bottom
C39  80.25,36.75 0 bottom
C40  86.75,40 90 bottom
C41  75.5,26.9 0 bottom
C42  68.75,27 0 bottom
C43  49,34 0 bottom
C44  55.5,35.5 90 bottom
D1  4.5,58.75 0 top
D2  22.5,43.75 90 bottom
D3  6.5,47.25 90 bottom
DUE1  74.86,25.46 0 top
IC1  72.07,35.13 90 bottom
IC2  61.5,46 90 bottom
IC3  80.25,31.5 270 bottom
IC4  80.25,41 270 bottom
IC5  75.5,24 270 bottom
IC6  68.75,24 270 bottom
IC$1  85.35,49.4 0 bottom
IC$2  72.9,46.55 180 bottom
IC$3  61,26.5 90 bottom
J1  47,18.5 270 top
J2  73,18.5 270 top
J3  60,18.5 270 top
J4  99.2,24.4 180 top
J5  4.25,70.5 270 top
J6  99.2,13.9 180 top
J7  99.2,19.1 180 top
J8  99.3,49.4 180 top
J9  99.3,54.7 180 top
L1  15.08,73.25 180 bottom
L2  18,34.25 90 bottom
L4  39.25,12.25 0 bottom
L5  39.25,14.5 0 bottom
L6  10.5,58.5 270 bottom
L7  22.75,4.35 270 bottom
L8  8.8,64.1 180 bottom
L9  6,34 90 bottom
Q1  22.25,36.25 0 bottom
Q2  11,35.25 0 bottom
R1  15,69.75 180 bottom
R2  18.75,73.25 0 bottom
R3  53.5,27 90 bottom
R4  83.6,45.9 0 bottom
R5  79.65,45.93 0 bottom
R6  63.46,32.42 0 bottom
R7  67.57,34.13 180 bottom
R8  67.57,36.28 180 bottom
R9  61.75,42.5 180 bottom
R10  67.3,43.75 0 bottom
R11  56.25,47.75 90 bottom
R12  54,46 90 bottom
R13  21.75,23.5 0 bottom
R14  27.25,29.25 270 bottom
R15  18,29 270 bottom
R16  5,53.5 90 bottom
R17  7.5,53.5 90 bottom
R18  27.75,32.75 90 bottom
R19  25.25,33.25 270 bottom
R20  18.25,44 270 bottom
R21  25.35,36.4 90 bottom
R22  27.75,36.5 90 bottom
R23  21.75,47.5 0 bottom
R24  25.75,47.5 0 bottom
R25  7.75,22.25 0 bottom
R26  5.25,25 90 bottom
R27  5.25,28.5 270 bottom
R28  6.25,43.75 270 bottom
R29  14,31.75 270 bottom
R30  11,40.4 180 bottom
R31  11,38.25 180 bottom
R32  15.95,27.5 270 bottom
R33  11,47.5 0 bottom
R34  14.75,47.5 0 bottom
R35  82,23.25 180 bottom
R36  88.5,27 0 bottom
R37  88.5,24.25 0 bottom
R38  85.5,26.25 90 bottom
R39  86.6,33.1 270 bottom
R40  86.75,43.75 90 bottom
R41  89.25,34.5 90 bottom
R42  89.25,38 90 bottom
U1  27.25,73 0 bottom
U2  89.25,74.25 90 bottom
U5  22.75,28 180 bottom
U6  10.75,28 180 bottom
U$1  18.5,7.5 0 top
U$2  99.5,79.5 0 top
U$3  18.5,11.3 0 bottom
U$4  89.3,66 0 bottom
X1  78.4,65.75 0 top

### Tracks (layer width: path | path; a pad name or v marks a point on that pad's centre or on a via)
!RESET  (via drill 0.41)
  Top 0.2: v34.7,24.9 57.5,47.7 64.2,47.7 v70.3,53.8
  Bottom 0.2: v34.7,24.9 34.7,15 33,13.3 33,7.7 DUE1.RESET | v70.3,53.8 71.2,53.8 72.5,55.1 72.5,57.3 80.9,65.7 X1.4
+3V3  (via drill 0.41)
  Top 0.2: v28.1,53.3 31.4,53.3 34.9,49.8 35.5,49.8 | 35.5,49.8 v55.8,49.8 v59.5,49.8 60.8,48.5 v62.3,48.5 | 35.5,49.8 v35.5,33.9 | v85.6,47.5 v87.7,47.5
  Bottom 0.2: 87.5,27.1 R38.2 | 87.5,27.1 87.6,27 R36.2 87.5,27.1 | 86.6,31.5 86.6,30.5 87.6,29.5 C35.2 87.5,29.5 87.5,27.1 | 86.6,31.5 R39.2 86.6,32.3 87.5,33.2 87.5,34.6 85.9,36.2 85.9,36.7 C38.2 85.9,36.8 85.9,39.8 86.1,40 89.2,40 | R35.2 82.8,23.2 82.6,23.2 81.8,22.4 80.5,22.4 79.1,23.8 79.1,30 78.9,30.2 76.4,30.2 76.2,30.4 76.2,32.6 77,33.4 77.6,33.4 IC3.8 77.7,33.4 78.3,33.4 80.85,30.85 | 80.85,30.85 82.1,29.6 82.8,29.6 IC3.4 | 86.6,31.5 81.5,31.5 80.85,30.85 | C10.1 94,72.9 90.3,72.9 U2.P$1 | U2.P$14 90.6,74.8 91.3,74.8 93.8,77.3 93.8,78.1 94,78.3 95.3,78.3 95.5,78.1 95.5,73.5 94.5,72.5 C10.1 | C10.1 94.4,72.4 93.7,71.7 93.7,69.5 94.5,68.7 C12.1 94.5,67.3 88.2,61 88.2,52.5 88.15,52.45 | 80.15,42.45 79.7,42.9 77.7,42.9 IC4.8 | 80.15,42.45 80.2,42.4 80.2,41.1 82.2,39.1 82.8,39.1 IC4.4 | 88.15,52.45 89.6,51 89.6,49.4 88.8,48.6 C5.2 88.8,48.1 87.95,47.25 | 88.15,52.45 88.1,52.5 86.7,52.5 85.1,50.9 85.1,50.3 IC$1.6 | 86.8,44.6 86.8,46.1 87.95,47.25 | 89.2,40 89.2,42.2 86.8,44.6 | 89.2,40 89.2,38.9 R42.2 | 86.8,44.6 R40.2 86.7,44.6 85.9,43.8 81.9,43.8 80.6,42.5 80.2,42.5 80.15,42.45 | IC$1.10 86.2,48.8 85.9,48.5 IC$1.1 85.6,48.5 v85.6,47.5 85.6,47 84.5,45.9 R4.1 84.4,45.9 83.5,45 79.9,45 79,45.9 78.8,45.9 | C18.2 55.8,41.4 61.5,41.4 R9.2 62.6,43.3 63.4,44.1 IC2.8 | IC$2.P$5 76,47.6 76.5,47.6 77,48.1 77,49 75.5,50.5 75.3,50.5 C15.1 75.2,50.6 75,50.6 74.2,51.4 65.7,51.4 62.75,48.45 | IC2.8 64.1,44 64.3,43.8 66.4,43.8 R10.2 67.3,42.9 74.7,42.9 77.7,45.9 78.8,45.9 | 62.75,48.45 62.7,48.4 62.7,44.9 63.5,44.1 IC2.8 | 78.8,45.9 R5.2 | DUE1.3V3 35.5,7.7 37.5,9.7 37.5,12.2 L4.2 37.6,12.3 37.6,14.5 L5.2 37.5,14.5 37.5,16 35.5,18 v35.5,33.9
  Bottom 0.2: U2.P$8 87.9,74.7 77.4,74.7 59.5,56.8 v59.5,49.8 59.5,48.6 58.9,48 IC2.4 | v55.8,49.8 56.2,49.4 56.2,48.6 R11.2 | v28.1,53.3 15,53.3 11.5,56.8 10.5,56.8 L6.2 | v62.3,48.5 62.7,48.5 62.75,48.45 | v87.7,47.5 87.95,47.25
+5V  (via drill 0.41)
  Top 0.2: X1.1 73.4,65.7 73.4,61 77.2,57.2 77.2,18.8 76.9,18.5 J2.1 68.5,10.2 40.6,10.2 38.1,7.7 DUE1.5V | v10.1,24.8 v10.1,23.2 10.8,22.5 14.7,22.5 15.2,23 15.2,26.8 14.4,27.6 v14.4,28.8 | v16.9,34 16.4,34 15.8,34.6 13.8,34.6 13.3,34.1 13.3,32.9 v16.2,30
  Bottom 0.2: C20.1 20.6,32.3 L2.1 18,32.9 v16.9,34 | v10.1,24.8 10.7,25.4 10.7,26.1 U6.11 | C32.1 11.1,23.2 v10.1,23.2 9.8,22.9 | 9.8,22.9 9.2,22.3 8.6,22.3 R25.1 | C33.1 11.4,23 11.2,23.2 C32.1 | 16.2,29.8 15.4,29.8 v14.4,28.8 | 16.2,29.8 18,29.8 R15.1 | L9.1 6,30.1 7.2,28.9 7.2,27.2 6.9,26.9 6.9,25.8 9.8,22.9 | 16.2,29.8 v16.2,30 | 23.85,24.75 23.9,24.7 27.2,24.7 C21.1 | 23.85,24.75 22.8,25.8 22.8,26.1 U5.11 22.8,25.7 22.2,25.1 18.3,25.1 16.7,23.5 15.3,23.5 14.5,24.3 12.3,24.3 11.5,23.5 C32.1 | DUE1.5V 38,7.6 37.7,7.6 35.9,5.8 32.5,5.8 31.5,6.8 31.5,10 23.2,18.3 23.2,22.6 23.8,23.2 23.8,24.7 23.85,24.75
ACCELINT1
  Bottom 0.2: U2.P$11 89.2,75.6 89.2,76.1 88.2,77.1 69,77.1 50.1,58.2 39,58.2 36.8,56 DUE1.10
ACCELINT2  (via drill 0.41)
  Top 0.2: v68.5,75.5 49.3,75.5 31.6,57.8 31,57.8 DUE1.13
  Bottom 0.2: v68.5,75.5 88.2,75.5 U2.P$9
ACCELINT3  (via drill 0.41)
  Top 0.2: v87,51.7 87,54.4 88.2,55.6 88.2,75.8 88.4,76 88.4,76.6 87.9,77.1 50.3,77.1 31.4,58.2 23.8,58.2 21.6,56 DUE1.SDA1
  Bottom 0.2: v87,51.7 85.6,50.3 IC$1.7
ACCELSA0
  Bottom 0.2: U2.P$7 87.9,74.2 87.5,74.2 82,68.7 82,64.1 74.7,56.8 74.7,54.8 72.1,52.2 64.3,52.2 60.3,48.2 60.3,47.4 60.2,47.3 57.7,47.3 57.1,46.7 57.1,46.2 57,46.1 55.5,46.1 54.9,46.7 54.9,49.2 48.2,55.9 DUE1.6
ACCELSA1  (via drill 0.41)
  Top 0.2: v79,52.3 79,53.3 77.6,54.7 77.6,61.7 74.4,64.9 74.4,67 73.8,67.6 57.3,67.6 45.7,56 DUE1.7
  Bottom 0.2: IC$1.5 81.3,50 v79,52.3
AMP2A
  Bottom 0.2: IC$3.3 58.3,27.2 57.7,27.2 50.7,34.2 50.7,34.7 50.6,34.8 49.1,34.8 49,34.7 49,21.7 45.8,18.5 J1.3 46.2,18.8 48.1,16.9 56.5,16.9 65.7,7.7 65.9,7.7 DUE1.A6
AMP2B  (via drill 0.41)
  Top 0.2: v62.4,29.7 62.1,29.7 50.9,18.5 J1.1
  Bottom 0.2: v62.4,29.7 63.6,28.5 IC$3.5 | DUE1.A7 68.5,7.7 68.2,7.7 58.6,17.3 52.1,17.3 50.9,18.5 J1.1
GND  (via drill 0.35, 0.41)
  Top 0.2: DUE1.GND_1 40.6,7.7 43.1,7.7 DUE1.GND_2 | 13.8,25.4 13.8,23.9 v14.4,23.3 | 13.8,25.4 v13.8,27.1 | v8.8,46.1 8.8,57 5.8,60 D1.4 5.7,60.1 3.3,60.1 D1.2 | v29,31.6 v29,34.4 | 13.8,25.4 12.1,25.4 8.8,28.7 v8.8,34.1 | J8.2 99.3,51.3 98.15,52.45 | 98.15,52.45 98.1,52.5 98.1,54.7 99.3,55.9 J9.2 | v92.1,73.8 92.1,74.7 v91.1,75.7 | DUE1.GND_A 94,12.8 96.4,12.8 DUE1.GND_B 96.5,12.8 98.8,15.1 99.2,15.1 J6.2 98.7,15.1 98,15.8 98,18.8 99.2,20 J7.2 99.2,21 100.4,22.2 100.4,24.4 99.2,25.6 J4.2 99.2,25.7 98.3,26.6 93.8,26.6 89.25,31.15 | v87.6,76.3 87.6,69.9 83.5,65.8 X1.5 83.4,65.7 83.4,60.4 79.8,56.8 79.8,49.9 79.3,49.4 79.3,48.5 79.95,47.85 | 89.25,31.15 87,33.4 v85.3,33.4 83.4,35.3 83.4,36.8 | 83.4,36.8 83.4,38.3 84.7,39.6 v84.7,41.7 85.5,42.5 85.5,43.2 85.05,43.65 | 79.95,47.85 84.1,43.7 85,43.7 85.05,43.65 | v80,47.9 79.95,47.85 | v89.3,31.2 89.25,31.15 | 85.05,43.65 93.4,52 96.6,52 97,52.4 98.1,52.4 98.15,52.45 | 83.4,36.8 v82.9,36.8
  Top 0.254: v6,62.5 6,60.4 5.7,60.1
  Bottom 0.2: v13.8,27.1 12.7,27.1 U6.9 | C33.2 C32.2 13.3,23.3 v14.4,23.3 15,22.7 16,22.7 | 16,22.7 16.5,22.7 18.5,24.7 21.2,24.7 22.4,23.5 R13.1 22.7,23.4 22.7,6.1 L7.1 22.8,6 23.4,5.4 38,5.4 40.2,7.6 40.5,7.6 DUE1.GND_1 | 16,22.7 C30.2 | C29.2 10.2,42.5 10.2,44.7 C31.2 v8.8,46.1 | D1.4 5.8,60 7.1,58.7 8,58.7 C27.2 8,58.6 23.7,58.6 26.3,56 26.6,56 | 5.45,39.95 5.2,40.2 5.2,46.1 D3.1 5.4,46.5 6.5,47.6 6.5,47.9 7.05,48.45 | 5.45,39.95 5.5,39.9 6.2,39.9 7.8,38.3 10.1,38.3 R31.1 | R26.1 5.2,24.2 5.2,24.4 4.4,25.2 4.4,28.5 R27.1 4,30.6 4,33.2 4.75,33.95 | 4.75,33.95 4.9,34.1 v8.8,34.1 10,34.1 Q2.2 | 4.75,33.95 3.9,34.8 3.9,37.5 5.4,39 5.4,39.9 5.45,39.95 | R34.1 15.5,47.4 15.5,45.2 C34.2 | R34.1 19.3,47.5 20.3,48.5 25.5,48.5 26.5,47.5 R24.1 24.8,45.7 C28.2 24.8,43.4 26.9,41.3 | 26.4,27.1 26.5,27.1 C21.2 | 26.4,27.1 24.7,27.1 U5.9 | 26.4,27.1 26.4,29.1 27.2,29.9 27.2,30.1 R14.1 27.5,30.1 v29,31.6 29,32.7 30.2,33.9 30.2,38.9 C22.2 27.7,41.3 26.9,41.3 | v29,34.4 R22.1 | C20.2 22.3,32.3 22.3,34.1 21.3,35.1 Q1.2 21.3,35 20,35 19.8,34.8 16.2,34.8 15.9,35.1 15.9,38 17.5,39.6 20.3,39.6 20.7,39.2 22.2,39.2 23.1,40.1 | 23.1,40.1 24.8,40.1 C24.2 26.9,41.3 | D2.1 21.4,41.9 23.1,40.2 C23.2 23.1,40.1 | 7.05,48.45 7.1,48.5 14.5,48.5 15.5,47.5 R34.1 | 7.05,48.45 2.1,53.4 2.1,57.9 3.2,59 3.2,60 D1.2 | 59.8,25.2 59.8,23.9 58,22.1 C13.2 58,22 58.8,21.2 63.8,21.2 C14.1 68.7,22 69.7,23 70,23 IC6.3 70.1,23.1 72.9,23.1 73.5,23.7 75.9,23.7 | 59.8,25.2 59.8,27.6 59,28.4 58.4,28.4 IC$3.4 58.3,28.5 50.25,36.55 | 59.8,25.2 56.3,25.2 54.5,27 52.8,27 52.6,26.8 52.6,24.7 48.3,20.4 48.3,18.5 J1.2
  Bottom 0.2: 57.5,36.4 55.5,36.4 C44.2 | 57.5,36.4 59.5,36.4 | 57.5,36.4 C11.1 | 75.9,23.7 75.9,26.5 76.3,26.9 C41.1 76.2,26.9 75.4,27.7 73.4,27.7 72.7,27 C42.1 67.6,29 67.6,36.9 67.3,37.2 66.1,37.2 65.3,36.4 59.5,36.4 | 75.9,23.7 75.9,23.6 76.4,23.1 76.7,23.1 IC5.3 76.7,23 74.3,20.6 74.3,18.5 J2.2 | 59.5,36.4 C7.1 | 86.3,50 86.3,49.4 | 86.3,50 88.6,50 88.8,50.2 C5.1 | 86.3,50 IC$1.8 | IC1.3 70.8,36.1 70.8,38 70.9,38.1 C16.1 | C38.1 84.1,36.8 v82.9,36.8 81.1,36.8 C39.1 81.1,36.7 80.3,35.9 78.7,35.9 75.65,38.95 | 75.65,38.95 75.6,39 72,39 71.2,38.2 71,38.2 C16.1 | 86.3,49.4 86.6,49.4 86.9,49.1 86.9,46.8 84.3,44.2 77.1,44.2 75.7,42.8 75.7,39 75.65,38.95 | 86.3,49.4 IC$1.9 | 48.2,32 48.2,30 C6.1 | 48.2,32 48.2,34 | 48.2,32 C4.1 | 54.9,45.1 57.3,45.1 58.3,44.1 IC2.1 | 54.9,45.1 54,45.1 R12.1 | 54.95,40.65 54.9,40.7 54.9,45.1 | 54.95,40.65 55.7,39.9 55.7,39.7 C18.1 57.3,38.1 70.8,38.1 C16.1 | 48.2,34 48.2,34.5 48.25,34.55 | 50.25,36.55 54.3,40.6 54.9,40.6 54.95,40.65 | 50.25,36.55 48.25,34.55 | 48.2,34 C43.2 | 48.25,34.55 47.2,35.6 39.7,35.6 38.9,34.8 38.7,34.8 C26.2 38.6,34.8 38.3,34.8 C25.2 35.7,37.4 35.7,56.8 34.3,58.2 28.5,58.2 26.6,56.3 26.6,56 | U2.P$16 90.6,73.8 v92.1,73.8 94.2,73.8 C10.2 94.6,74.2 94.6,75.7 C8.2 | U2.P$12 89.8,75.6 90.2,75.6 U2.P$13 90.3,75.6 90.7,75.6 90.95,75.85 | 90.95,75.85 93.8,78.7 95.5,78.7 95.9,78.3 95.9,71.8 94.5,70.4 C12.2 94.5,70.3 99.3,65.5 J9.2 | 90.95,75.85 v91.1,75.7 | C36.1 86.4,21.2 86.9,20.7 88.5,20.7 89.3,21.5 C37.1 89.4,21.5 89.4,24.2 R37.1 89.4,24.3 89.4,25.5 90.2,26.3 90.2,28.7 89.4,29.5 C35.1 89.3,29.5 v89.3,31.2 89.3,33.6 R41.1 86.8,36.1 86.8,39.1 C40.1
  Bottom 0.2: 71.75,48.05 72.2,47.6 72.7,47.6 IC$2.P$2 | 71.75,48.05 71.7,48.1 71.7,49 73.2,50.5 73.5,50.5 C15.2 | IC$1.3 82.3,48.8 81.9,49.2 81.3,49.2 v80,47.9 78.9,46.8 78,46.8 77,45.8 70.6,45.8 | 70.6,45.8 C19.1 C17.1 | 71.75,48.05 70.6,46.9 70.6,45.8 | U2.P$5 88.2,72.9 88.2,70.5 83.5,65.8 X1.5 | v87.6,76.3 88.4,76.3 88.7,76 88.7,75.6 U2.P$10 | v85.3,33.4 82.9,33.4 IC3.1 | v84.7,41.7 83.5,42.9 82.9,42.9 IC4.1 | 26.6,56 DUE1.GND1
  Bottom 0.254: L8.1 7.12,63.62 v6,62.5
  other vias: 87,10.5 69,14 65,17 22.5,14 41,42.5 41.5,51 63,35.5 65,65.5 70.5,73.5 70,62.5 43,12 58,12 16,42 20.5,21 49,38 57,53.5
  pour Top: 1,99 118.5,99 118.5,0.5 1,0.5 1,6.5 11,6.5 11,19 2,19 1,20
  pour Bottom: 1,99 118.5,99 118.5,0.5 1,0.5 1,6.5 11,6.5 11,19 2,19 1,20
GPSGND
  Bottom 0.152: 34.5,77.5 34.5,78 33.5,79 20,79 19,78 19,75.25 18.75,75 18.75,71.95 19,71.7 19,71 19.2,70.8 U1.12 23.7,70.8 24,70.5 24,68.95 23.65,68.6 U1.10 | 34.5,77.5 32.2,77.5 U1.1 | 34.5,77.5 36,77.5 36.5,77 36.5,68.65 35.75,67.9 C3.2
  Bottom 0.254: L8.2 10.57,64
  Bottom 0.406: 10.57,64 13.5,64 C1.2 C2.2 16.5,64 18.5,64 20,65.5 20,68.5 22.3,68.5 U1.10 | J5.1 1.54,73.04 1.5,73 1.5,68 10.5,68 10.5,64.12 L8.2
GPSPPS  (via drill 0.35)
  Top 0.152: v35,73 38.5,73 v41,70.5 | v62,68.5 v55.5,68.5
  Bottom 0.152: U1.4 33.4,74.1 34.5,73 v35,73 | v41,70.5 46.19,70.5 47.19,69.5 54.51,69.5 v55.5,68.5 | DUE1.2 58.35,64.85 v62,68.5
GPSRX  (via drill 0.35)
  Top 0.152: v35,74.5 44,74.5 v44.5,74 | v55.5,70.5 73.6,70.5 77.1,67 77.1,64.23 79.48,61.86 79.48,60.52 v79.5,59
  Bottom 0.152: DUE1.TX1 78.67,58.17 v79.5,59 | U1.3 33.8,75.2 34.5,74.5 v35,74.5 | v44.5,74 52,74 v55.5,70.5
GPSTX  (via drill 0.35)
  Top 0.152: v81,60.5 81,62.55 79.75,63.8 79.75,70.25 78,72 56,72 v55.5,72.5 | v35,76 45,76 v45.5,75.5
  Bottom 0.152: U1.2 34.7,76.3 v35,76 | DUE1.RX1 81.21,60.29 v81,60.5 | v45.5,75.5 52.5,75.5 v55.5,72.5
LED1
  Bottom 0.2: R16.1 5,52.7 6,52.7 6.8,53.5 14.2,53.5 15.2,52.5 28.4,52.5 31.6,55.7 31.6,55.9 DUE1.12
LED2
  Bottom 0.2: R17.1 7.5,52.6 6.5,52.6 5.7,51.8 4.3,51.8 4.1,52 4.1,53.3 4.3,53.5 5.7,53.5 5.9,53.7 5.9,55.8 4.7,57 4.7,58 5.3,58.6 6.5,58.6 7.3,57.8 14.7,57.8 14.8,57.9 16.1,57.9 17.9,56.1 17.9,54.8 18.6,54.1 27.1,54.1 28,55 28,57.1 28.7,57.8 32.4,57.8 34.2,56 DUE1.11
LEDB
  Top 0.2: J9.1 99.3,53.4 100.5,52.2 100.5,50.2 99.3,49 J8.1 99.3,27.2 100.8,25.7 100.8,12.1 98.3,9.6 75.5,9.6 73.6,7.7 DUE1.A8
  Bottom 0.2: DUE1.A8 73.5,7.6 70.7,7.6 68.9,5.8 55.4,5.8 54.4,6.8 54.4,8.8 49.6,13.6 40.1,13.6 39.9,13.8 39.9,15.3 43.1,18.5 J1.4
MAX1932!CL  (via drill 0.41)
  Top 0.2: v14.1,33.8 16,33.8 16.95,32.85 | 16.95,32.85 20.1,29.7 20.1,28.7 v19.7,28.3 | v32.5,53.3 52.9,53.3 55.5,55.9 55.8,55.9 DUE1.3 | v30.8,51.6 19.3,51.6 17.7,50 17.7,33.6 16.95,32.85
  Bottom 0.2: v14.1,33.8 12.7,35.2 11.3,35.2 11.1,35 11.1,33.5 10.7,33.1 10.1,33.1 8.8,31.8 8.8,28.9 U6.3 | v19.7,28.3 20,28.3 20.5,28.8 20.8,28.8 U5.3 | v30.8,51.6 v32.5,53.3
MAX1932!CS1  (via drill 0.41)
  Top 0.2: v20.3,26.2 20.3,26.6 18.9,28 18.9,29 18.95,29.05 | v19.3,29.4 18.95,29.05 | DUE1.TX3 68.5,56 65.7,56 63.9,57.8 50.3,57.8 49.3,56.8 49.3,54.8 48.6,54.1 21.2,54.1 13.9,46.8 13.9,35.3 12.9,34.3 12.9,32.2 16,29.1 18.9,29.1 18.95,29.05
  Bottom 0.2: v20.3,26.2 21.9,26.2 U5.12 | v19.3,29.4 18,28.1 R15.2
MAX1932!CS2  (via drill 0.41)
  Top 0.2: v7.6,24 v9,25.4 | v34.4,52.5 67.4,52.5 70.8,55.9 71,55.9 DUE1.RX3 | v15.9,51.3 5.1,40.5 5.1,22.8 v6.9,21
  Bottom 0.2: v9,25.4 9.7,26.1 9.9,26.1 U6.12 | v7.6,24 7.6,23 6.9,22.3 R25.2 v6.9,21 | v34.4,52.5 32.8,54.1 30.6,54.1 27.8,51.3 v15.9,51.3
MAX1932DIN  (via drill 0.41)
  Top 0.2: v7.8,29.4 6.9,28.5 v6.4,28.5 5.9,28 5.9,24.6 11.3,19.2 v24,19.2 | v33.1,15.3 40,22.2 40,27.7 56.8,44.5 62.1,44.5 73.5,55.9 DUE1.TX2
  Bottom 0.2: U5.2 20.6,28 20.1,27.5 19.7,27.5 19.5,27.3 17.3,27.3 17.1,27.5 15.3,27.5 13.1,25.3 11.7,25.3 10.4,24 9.3,24 7.3,26 7.3,26.7 8.6,28 U6.2 8.5,28 7.8,28.7 v7.8,29.4 | v6.4,28.5 5.6,27.7 5.3,27.7 R27.2 | R14.2 27.3,28.4 27.3,27.8 28.1,27 28.1,23.3 v24,19.2 24.1,19.2 24.1,18 29.4,12.7 31.8,12.7 33.1,14 v33.1,15.3
MAX1932SCLK  (via drill 0.41)
  Top 0.2: v8.1,26.4 6.7,25 v6.7,24.9 | v18.5,25.9 18.5,25.1 v19.7,23.9 | v49.8,59 72.8,59 75.8,56 76.1,56 DUE1.RX2
  Bottom 0.2: v8.1,26.4 8.8,27.1 U6.1 | v6.7,24.9 6.2,24.9 6.15,24.95 | R26.2 6.15,24.95 | v18.5,25.9 18.7,25.9 19.9,27.1 20.8,27.1 U5.1 | R13.2 20.5,23.9 v19.7,23.9 16,20.2 6.6,20.2 6.1,20.7 6.1,23.3 | 6.1,23.3 6.1,24.9 6.15,24.95 | v49.8,59 15.4,59 13.2,61.2 2.9,61.2 1.7,60 1.7,26.2 4.6,23.3 6.1,23.3
N$1
  Bottom 0.254: 22.8,2.6 22.8,1
N$2  (via drill 0.41)
  Top 0.2: v66.7,32.8 58.4,24.5 v58.4,23.6
  Bottom 0.2: v66.7,32.8 66.7,34.1 R7.1 | v58.4,23.6 58.4,24.5 IC$3.1
N$4
  Bottom 0.2: R8.1 66.7,36.2 66.7,35.6 65.2,34.1 65.2,26.8 64.3,25.9 63.7,25.9 IC$3.7
N$5
  Bottom 0.2: C17.2 64.1,48 IC2.5
N$6
  Bottom 0.2: 64.45,45.75 64.1,45.4 IC2.7 | 64.45,45.75 64.5,45.8 C19.2 68.1,44.1 68.1,43.8 R10.1 | IC2.6 64.1,46.1 64.45,45.75
N$7
  Bottom 0.2: C36.2 81.1,21.2 78,24.3 78,29.2 77.7,29.5 IC3.5
N$8  (via drill 0.41)
  Top 0.2: v12.4,26.2 12.4,30.5 v10.6,32.3
  Bottom 0.2: v12.4,26.2 11.6,26.2 U6.10 | v10.6,32.3 11.9,33.6 11.9,34.1 Q2.1
N$9
  Bottom 0.2: 6.2,36.4 6.2,36.2 6,36 L9.2 6.2,36.4 | 6.2,36.4 6.2,38.1 BAT46WH2.2 | 6.2,36.4 11,36.4 Q2.3
N$10  (via drill 0.41)
  Top 0.2: v9.7,31.5 9.7,37.6 v7.5,39.8
  Bottom 0.2: v9.7,31.5 9.9,31.3 9.9,29.9 U6.4 | 6.3,40.9 6.4,40.9 v7.5,39.8 7.5,39.9 9,41.4 10.7,41.4 11.8,42.5 C29.1 | 6.3,40.9 6.3,42.9 R28.2 | 6.3,40.9 BAT46WH2.1
N$11
  Bottom 0.2: R29.1 11.6,30.2 11.6,29.9 U6.6
N$12
  Bottom 0.2: U6.8 15.6,28 R32.1
N$13
  Bottom 0.2: C30.1 16,26.6 R32.2
N$14
  Bottom 0.2: U6.7 12.7,28.9 12.7,29.6 R29.2 14,31.1 14.9,32 14.9,35.2 R31.2 10.2,39.9 10.2,40.4 R30.1
N$17
  Bottom 0.2: IC3.7 77.7,32.1 77.7,30.9 IC3.6 77.8,30.9 79.2,30.9 84.6,25.5 84.6,24.7 87.4,21.9 87.7,21.9 C37.2 87.7,21.5 87.7,21.8 88.5,22.6 88.5,26.2 89.3,27 R36.1
N$18  (via drill 0.41)
  Top 0.2: v72.4,36.9 72.4,37.1 65.8,43.7 v61.9,43.7
  Bottom 0.2: v72.4,36.9 72.5,36.9 73.3,36.1 IC1.4 | v61.9,43.7 61.9,43.5 61.65,43.25 | R9.1 61.65,43.25 | 61.65,43.25 59.6,45.3 58.9,45.3 IC2.2
N$19  (via drill 0.41)
  Top 0.2: v24.4,26.2 24.4,36.8 v26.1,38.5
  Bottom 0.2: v24.4,26.2 23.6,26.2 U5.10 | v26.1,38.5 25,38.5 23.2,36.7 Q1.1
N$21
  Bottom 0.2: C39.2 79.4,37.3 77.7,39 IC4.5
N$22  (via drill 0.41)
  Top 0.2: v84.7,42.9 80.2,42.9 v79.4,42.1
  Bottom 0.2: C40.2 86.8,40.9 86.8,42.9 R40.1 v84.7,42.9 | v79.4,42.1 78.1,42.1 77.7,41.7 IC4.7 77.7,41.6 77.7,40.4 IC4.6
N$24  (via drill 0.41)
  Top 0.2: v68.7,23.1 71,23.1 75,27.1 v75,33.2
  Bottom 0.2: v68.7,23.1 67.5,23.1 IC6.4 | v75,33.2 76.3,34.5 85,34.5 | 85,34.5 86.1,34.5 86.6,34 R39.1 | 85,34.5 85,40.1 83.5,41.6 82.9,41.6 IC4.2
N$25
  Bottom 0.2: IC5.4 74.2,21.1 73.1,20 73.1,18 73.8,17.3 78.6,17.3 81.05,19.75 | 81.05,19.75 81.7,20.4 81.9,20.4 82,20.5 82,21.9 82.5,22.4 83.5,22.4 83.7,22.6 83.7,23.9 83.5,24.1 82,24.1 R35.1 | 81.05,19.75 77.6,23.2 77.6,27.8 75.8,29.6 75.8,33.4 76.5,34.1 78.8,34.1 80.7,32.2 82.8,32.2 IC3.2
N$31
  Bottom 0.2: 18.2,37.4 18.2,36.4 L2.2 | 18.2,37.4 18.2,38.6 BAT46WH1.2 | 18.2,37.4 22.2,37.4 Q1.3
N$32
  Bottom 0.2: U5.4 21.9,29.9 20,29.9 19,30.9 16.2,30.9 15.4,31.7 15.4,38.6 18.2,41.4 BAT46WH1.1 18.3,41.4 | 18.3,41.4 18.3,43.1 R20.2 | 18.3,41.4 19.5,40.2 21.4,40.2 C23.1
N$47
  Bottom 0.2: U5.7 24.7,28.9 24.7,31.9 25.2,32.4 R19.2 25.3,32.4 26.05,33.15 | R21.1 26.1,34.8 26.1,33.2 26.05,33.15 | 26.05,33.15 26.4,32.8 28.5,32.8 29.8,34.1 29.8,35.1 27.8,37.1 27.8,37.3 R22.2
N$53
  Bottom 0.406: J5.5 12,70.5 12.75,69.75 R1.1 | R1.1 14.15,68.65 14,68.5 13.5,68.5 C1.1 | L1.1 14.19,69.79 R1.1
N$54
  Bottom 0.2: U5.6 23.6,29.9 23.6,32.5 25.2,34.1 R19.1
N$55
  Bottom 0.2: U5.8 24.9,28 26,29.1 26,30.4 27.5,31.9 R18.1
N$56
  Bottom 0.2: C22.1 26.9,38.8 26.9,35 27.7,34.2 27.7,33.6 R18.2
N$63
  Bottom 0.2: C9.1 89.3,70.6 89.3,72.9 U2.P$3
N$64
  Bottom 0.2: C9.2 89.8,71.8 89.8,72.9 U2.P$2
N$65
  Bottom 0.2: C8.1 91.5,74.3 90.6,74.3 U2.P$15
N$66
  Bottom 0.406: L1.2 R2.2
N$67
  Bottom 0.406: R2.1 20.75,73.25 21,73 U1.14
N$68
  Bottom 0.406: C2.1 16.5,68.5 16,68.5 15.85,68.65 R1.2 15.9,69.7 U1.11
N$72
  Bottom 0.2: R16.2 5,55.7 3.3,57.4 D1.1
N$73
  Bottom 0.2: R17.2 7.5,55.7 5.8,57.4 D1.3
PSUF1  (via drill 0.41)
  Top 0.2: v60.9,22.1 56.5,22.1 51.7,17.3 v40.3,17.3
  Bottom 0.2: 62.9,22.1 62.9,23.8 63.6,24.5 IC$3.8 | 62.9,22.1 v60.9,22.1 59.7,22.1 C13.1 | 62.9,22.1 C14.2 | 40,17.3 40,16 39.5,15.5 39.5,13.6 40.9,12.2 L4.1 | 40,17.3 40,18.6 36.3,22.3 36.3,35.1 C25.1 | 40,17.3 v40.3,17.3
PSUF2  (via drill 0.41)
  Top 0.2: v73.3,26.5 v73.3,32.6 68,32.6 67,33.6 47,33.6 v46.9,33.5
  Bottom 0.2: C16.2 74.2,36.6 74.2,35.6 73.4,34.8 73.4,34.2 IC1.5 73.3,34.1 v73.3,32.6 | 74.2,25.8 74.2,26.5 74.6,26.9 C41.2 | 74.2,25.8 IC5.5 | 67.5,25.8 67.5,26.6 C42.2 | 67.5,25.8 67.5,25 IC6.5 | 67.5,25.8 73.3,25.8 | 73.3,25.8 74.2,25.8 | 73.3,25.8 v73.3,26.5 | 40.4,33.5 40.4,22.9 44.4,18.9 44.4,17.9 41,14.5 L5.1 | 40.4,33.5 40.4,34.7 C26.1 | 40.4,33.5 v46.9,33.5
PSUF3  (via drill 0.35)
  Top 0.152: v12.5,60 22,60 v25,63
  Bottom 0.152: 33.5,69.65 32.15,69.65 U1.8 | 33.5,69.65 33.5,68.64 33.46,68.6 U1.9 33.4,68.6 34,68 34,65.15 | 34,65.15 C3.1 | U1.6 33.4,71.9 33.5,71.8 33.5,69.65 | L6.1 12.32,60.17 v12.5,60 | 34,65.15 33.35,64.55 26.65,64.55 v25,63
  Bottom 0.2: C27.1 8,60.3 10.4,60.3 10.5,60.2 L6.1
RX0
  Bottom 0.2: DUE1.RX0 63.5,56 66.3,56 74.2,63.9 76.6,63.9 78.4,65.7 X1.3
SCL0  (via drill 0.41)
  Top 0.2: DUE1.SCL 86.2,56 84.4,57.8 83.3,57.8 82.6,57.1 82.6,52.1 80.1,49.6 v80.1,49.1 80.8,48.4 v81.6,48.4
  Bottom 0.2: 83.45,46.55 82.8,45.9 R4.2 | 83.45,46.55 85.1,48.2 85.1,48.5 IC$1.2 | U2.P$4 88.7,72.9 88.7,67.1 86.3,64.7 86.3,56 DUE1.SCL | v80.1,49.1 79.7,49.1 77.2,46.6 76,46.6 IC$2.P$6 | v81.6,48.4 83.45,46.55
SDA0  (via drill 0.41)
  Top 0.2: v81.7,47.2 81.7,47.4 83.7,49.4 83.7,55.9 DUE1.SDA | v71.4,46.6 71.4,47 v76.4,52
  Bottom 0.2: IC$1.4 82.3,49.4 82.1,49.6 80.7,49.6 78.8,51.5 78.7,51.5 78.2,52 | 78.2,52 78.2,52.6 79.7,54.1 81.9,54.1 83.7,55.9 DUE1.SDA 83.7,56 82.4,57.3 82.4,68 87.9,73.5 87.9,73.7 U2.P$6 | v81.7,47.2 80.5,46 R5.1 | v71.4,46.6 72.7,46.6 IC$2.P$1 | 78.2,52 v76.4,52
STRIGA
  Bottom 0.2: IC5.2 76.8,24.9 IC5.1 76.8,25 76.8,25.8 77.2,26.2 77.2,27.6 70.7,34.1 IC1.1 70.7,34.2 68.5,34.2 R7.2
STRIGAOUT  (via drill 0.41)
  Top 0.2: 87.6,11.7 98.3,11.7 99.2,12.6 J6.1 | 87.6,11.7 77,11.7 75.1,9.8 65.8,9.8 63.7,7.7 63.5,7.7 DUE1.A5 | 87.6,11.7 v87.6,22.8
  Bottom 0.2: IC3.3 82.9,30.8 83.5,30.8 84.3,30 84.3,26.8 85.5,25.6 R38.1 86.6,24.3 87.6,24.3 R37.2 87.6,24.2 v87.6,22.8
STRIGB
  Bottom 0.2: 70.1,24.3 70.1,24.9 IC6.1 | 70.1,24.3 70.1,24 IC6.2 70.1,24.3 | IC1.2 70.7,35.2 69.5,35.2 R8.2 68.4,36.3 68.4,36.7 67.5,37.6 55.2,37.6 54.7,37.1 54.7,33.9 54.8,33.8 54.9,33.8 60.2,28.5 60.2,27.4 62.4,25.2 64.9,25.2 65.8,24.3 70.1,24.3
STRIGBOUT  (via drill 0.41)
  Top 0.2: v88.1,38 v84.2,38
  Bottom 0.2: v84.2,38 84.3,38.1 84.3,39.5 83.5,40.3 82.9,40.3 IC4.3 | v88.1,38 88.4,38 R42.1 89.3,37.1 89.3,35.4 R41.2 89.3,35.3 89.3,35.1 92.8,31.6 92.8,25 93.8,24 94.4,24 95.3,23.1 95.3,22.5 96.3,21.5 96.9,21.5 98,20.4 98,19.1 99.2,17.9 J7.1 98.6,18.4 96.9,16.7 96.3,16.7 95.3,15.7 95.3,15.1 94.4,14.2 93.1,14.2 87.7,8.8 87.7,6.8 86.3,5.4 53.3,5.4 51.1,7.6 50.8,7.6 DUE1.A0
TRIGOUT  (via drill 0.41)
  Top 0.2: v78,49.3 78,39.6 93.2,24.4 96.5,24.4 97.7,23.2 99.2,23.2 J4.1
  Bottom 0.2: R11.1 56.3,46.9 56.3,47.1 57.1,47.9 57.1,49.6 50.8,55.9 DUE1.5 50.7,56 50.4,56 48.6,57.8 47.8,57.8 47.1,57.1 47.1,53.8 54,46.9 R12.2 54,46.8 54.2,46.8 55.3,45.7 57.4,45.7 58.3,46.6 58.9,46.6 IC2.3 58.9,46.7 60.2,46.7 60.7,47.2 60.7,48 64.5,51.8 75.5,51.8 v78,49.3
TX0
  Bottom 0.2: DUE1.TX0 60.9,56 61.2,56 72.8,67.6 74,67.6 75.8,65.8 X1.2
UCDAC0
  Bottom 0.2: R3.1 53.5,24.9 58.7,19.7 66.3,19.7 76.5,9.5 81.9,9.5 83.7,7.7 DUE1.DAC0
UCDAC0F
  Bottom 0.2: 49.9,32 49.9,34 C43.1 | 49.9,30 52,27.9 53.5,27.9 R3.2 53.5,27.8 54.3,27.8 56.2,25.9 58.3,25.9 IC$3.2 | 49.9,30 49.9,32 | 49.9,32 C4.2 | 49.9,30 C6.2
UCDAC1  (via drill 0.41)
  Top 0.2: v64.4,29.4 64.4,25 v69.3,20.1
  Bottom 0.2: v64.4,29.4 64.4,32.4 R6.1 | v69.3,20.1 70.5,18.9 70.5,18 78.6,9.9 84,9.9 86.2,7.7 DUE1.DAC1
UCDAC1F
  Bottom 0.2: 57.5,34.7 55.5,34.7 C44.1 | 61.6,32.5 62.6,32.5 R6.2 | 61.6,32.5 59.5,34.6 C7.2 59.5,34.7 57.5,34.7 | 57.5,34.7 C11.2 | 61.6,32.5 61.6,28.5 62.9,27.2 63.6,27.2 IC$3.6
VBIAS1  (via drill 0.41)
  Top 0.2: J2.3 71.1,18.5 67.3,14.7 33.8,14.7 32.6,13.5 31.7,13.5 21.2,24 v21.2,31 21.2,31.4 v23.5,33.7 23.9,34.1 v23.9,41.4
  Bottom 0.2: 25.2,41.4 25.2,42.1 23.6,43.7 D2.3 23.6,44.3 20.7,47.2 R23.2 R20.1 | v21.2,31 22.2,31 22.7,30.5 22.7,29.9 U5.5 | v23.5,33.7 24.3,34.5 24.3,36.2 R21.2 | v23.9,41.4 25.2,41.4 | 25.2,41.4 C24.1
VBIAS2  (via drill 0.41)
  Top 0.2: v13,39.3 12,38.3 v12,32.5 12,32.4 15.8,28.6 17,28.6 19.4,26.2 19.4,25.9 20.6,24.7 20.6,23.8 33.7,10.7 68.2,10.7 75.5,18 75.5,19 74.7,19.8 71.2,19.8 69.9,18.5 J2.4
  Bottom 0.2: R28.1 6.3,44.6 6.3,45.4 7.6,46.7 D3.3 7.6,47.3 7.8,47.5 R33.2 10.2,47.5 10.2,46.7 11.8,45.1 11.8,44.8 C31.1 11.9,44.7 11.9,44.2 12.9,43.2 12.9,41.3 12,40.4 R30.2 11.9,40.4 v13,39.3 | v12,32.5 10.8,31.3 10.8,29.9 U6.5
VBIASFB1  (via drill 0.41)
  Top 0.2: v23.9,46.5 v26.3,44.1 | v29.7,13.5 34.1,9.1 34.1,6.8 35.1,5.8 56.2,5.8 58,7.6 58.3,7.6 DUE1.A3
  Bottom 0.2: R24.2 23.9,47.5 | 23.9,47.5 R23.1 | C28.1 26.5,44.3 v26.3,44.1 26.5,44.2 30.6,40.1 30.6,32.1 29.7,31.2 v29.7,13.5 | 23.9,47.5 v23.9,46.5
VBIASFB2  (via drill 0.41)
  Top 0.2: v11.9,46.2 11.9,45.4 5.5,39 5.5,24.4 24.5,5.4 58.6,5.4 60.8,7.6 DUE1.A4
  Bottom 0.2: C34.1 13.8,45.2 13.8,47.4 R34.2 11.9,47.5 | v11.9,46.2 11.9,47.5 | 11.9,47.5 R33.1
(copper drawn outside any net)
  shapes: Bottom area x5, Top area x3

### Text on the board
bPlace: Accel+Mag | GPS | HTU21D
tSilk: Pi Header | +5V | TX | RX | !RESET | GND | 05/10/17 | G | L | G | L | TRIG | Trigger Header | G | SigA | SigB | TempA | TempB | T | Vbias1 | LED | GND | Vbias2 | GND | +5V | G | B | G | Analogue Header / Version 2.4+ | A | Main PCB Version 2.5 / www.ohwr.org/projects/cosmic-pi | Released under the CERN OHL V1.2